# EAGLE design tool-board-atmega (EAGLE 9.4.2)
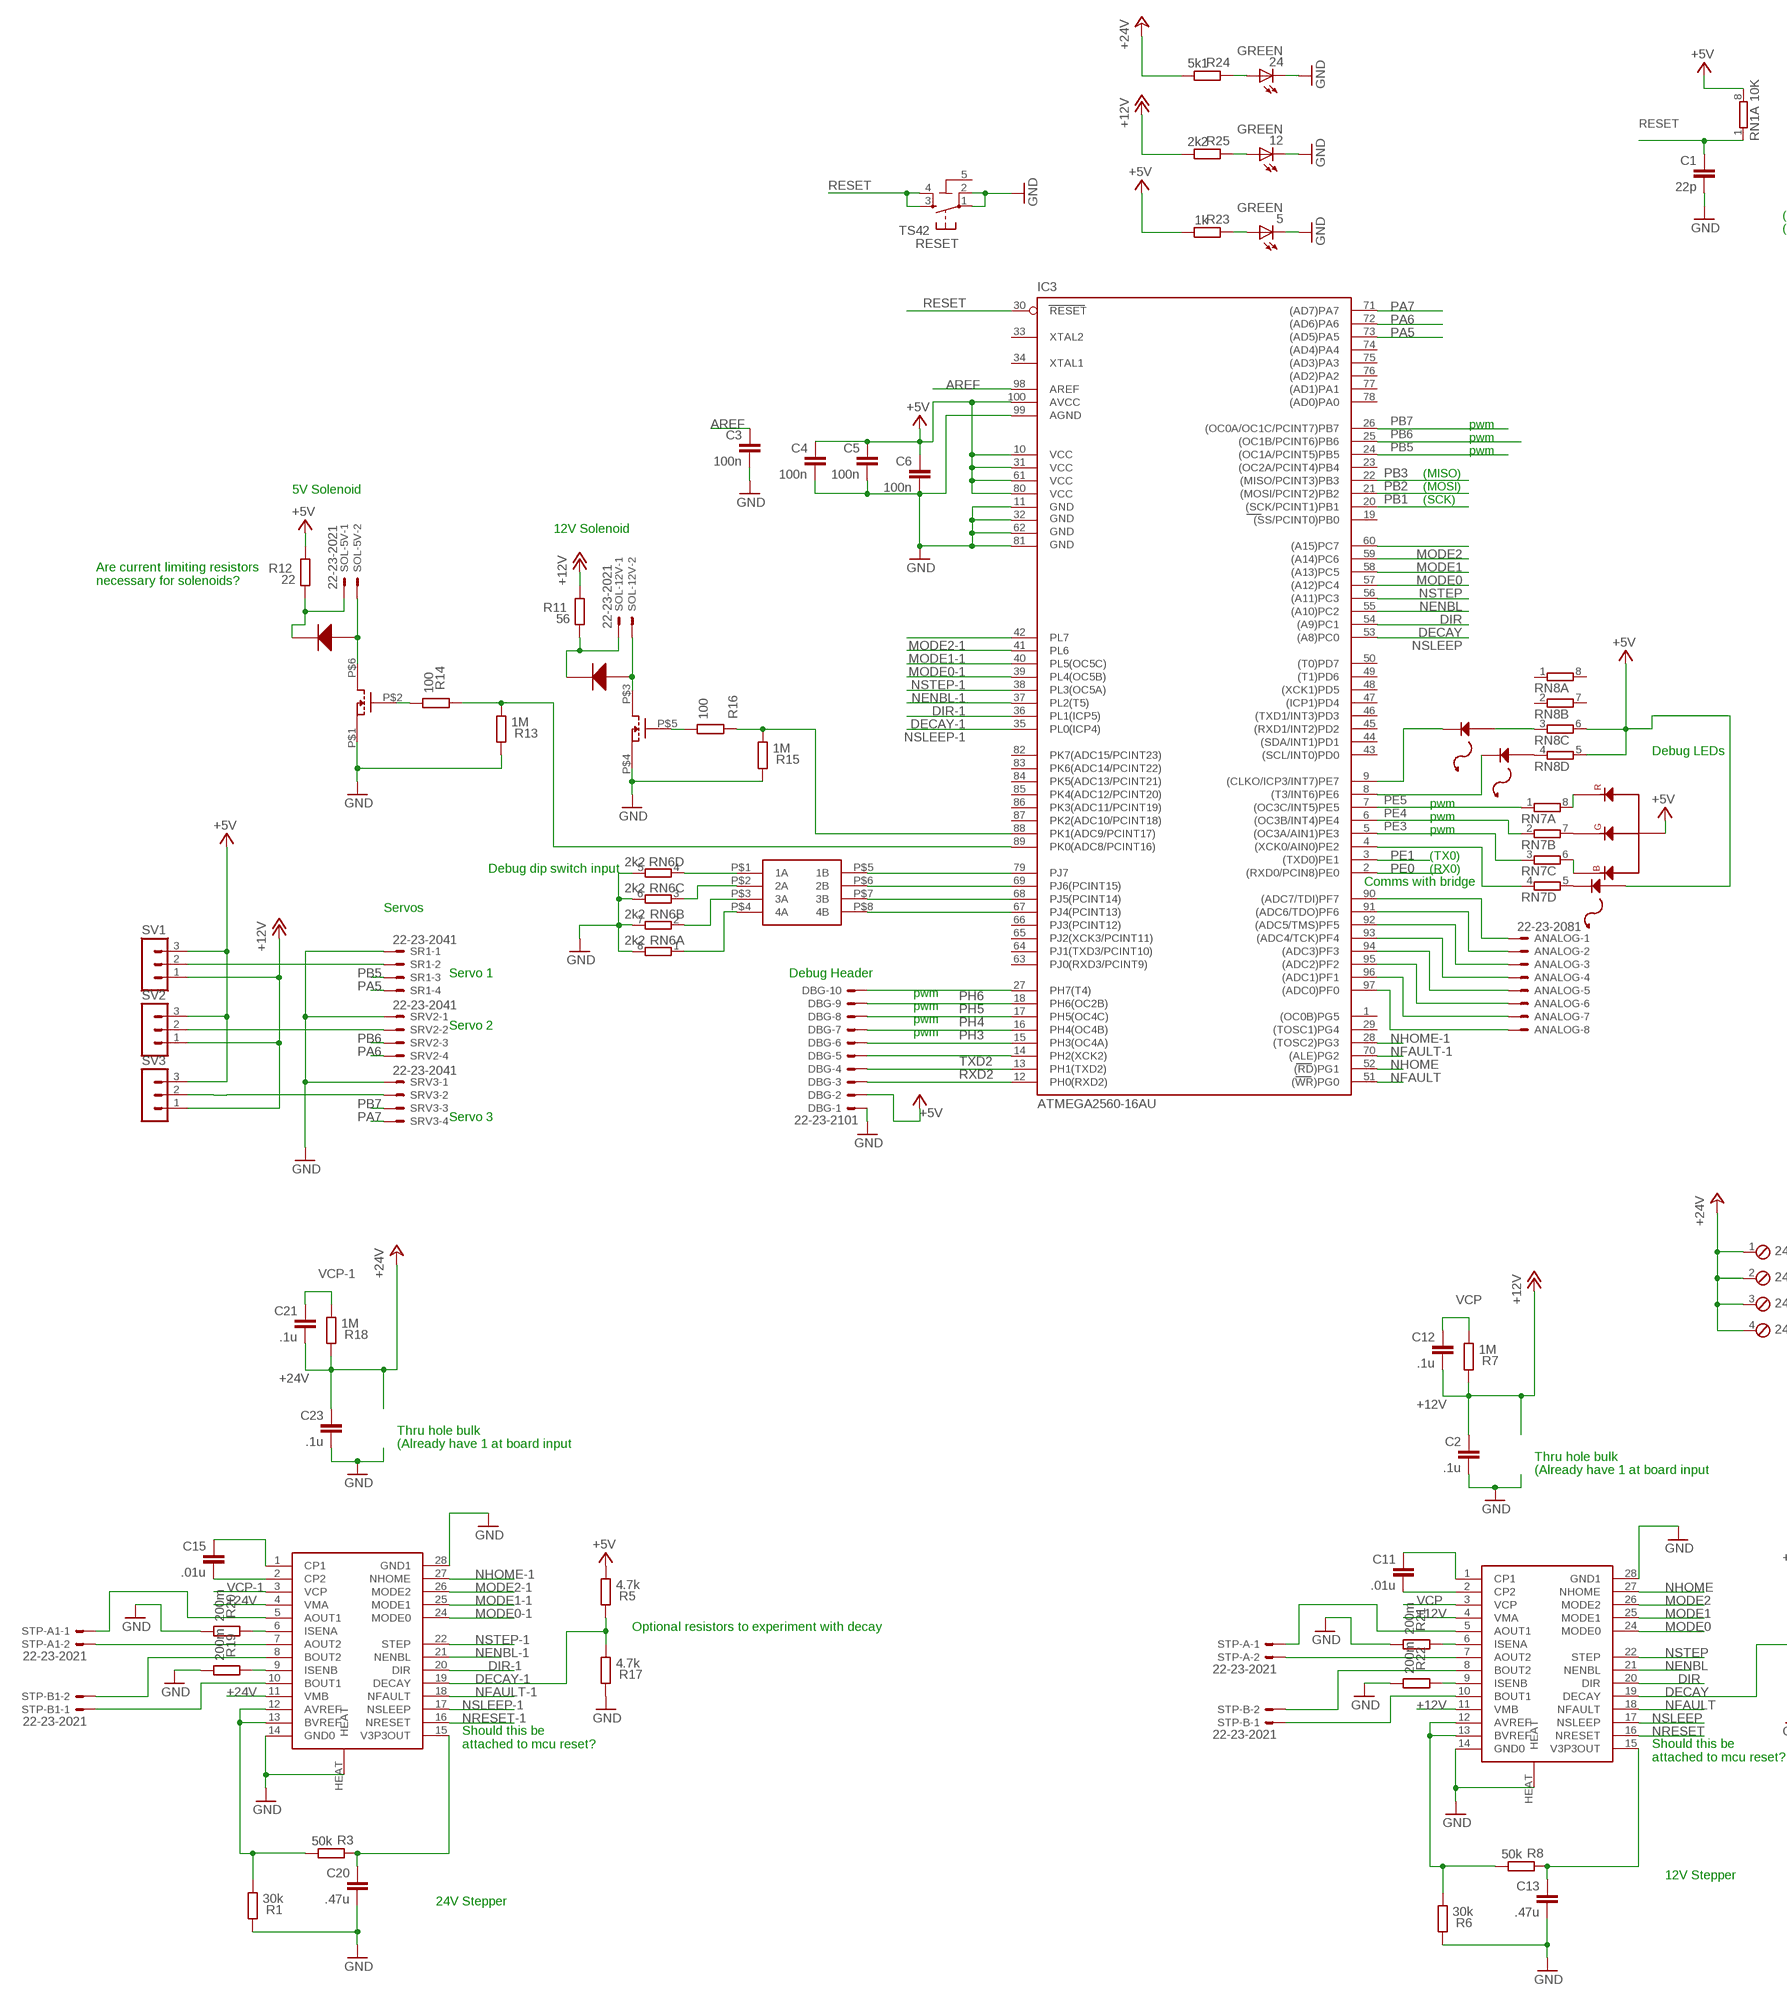
[diagram p0: schematic, sheet 1, part 1 of 2]
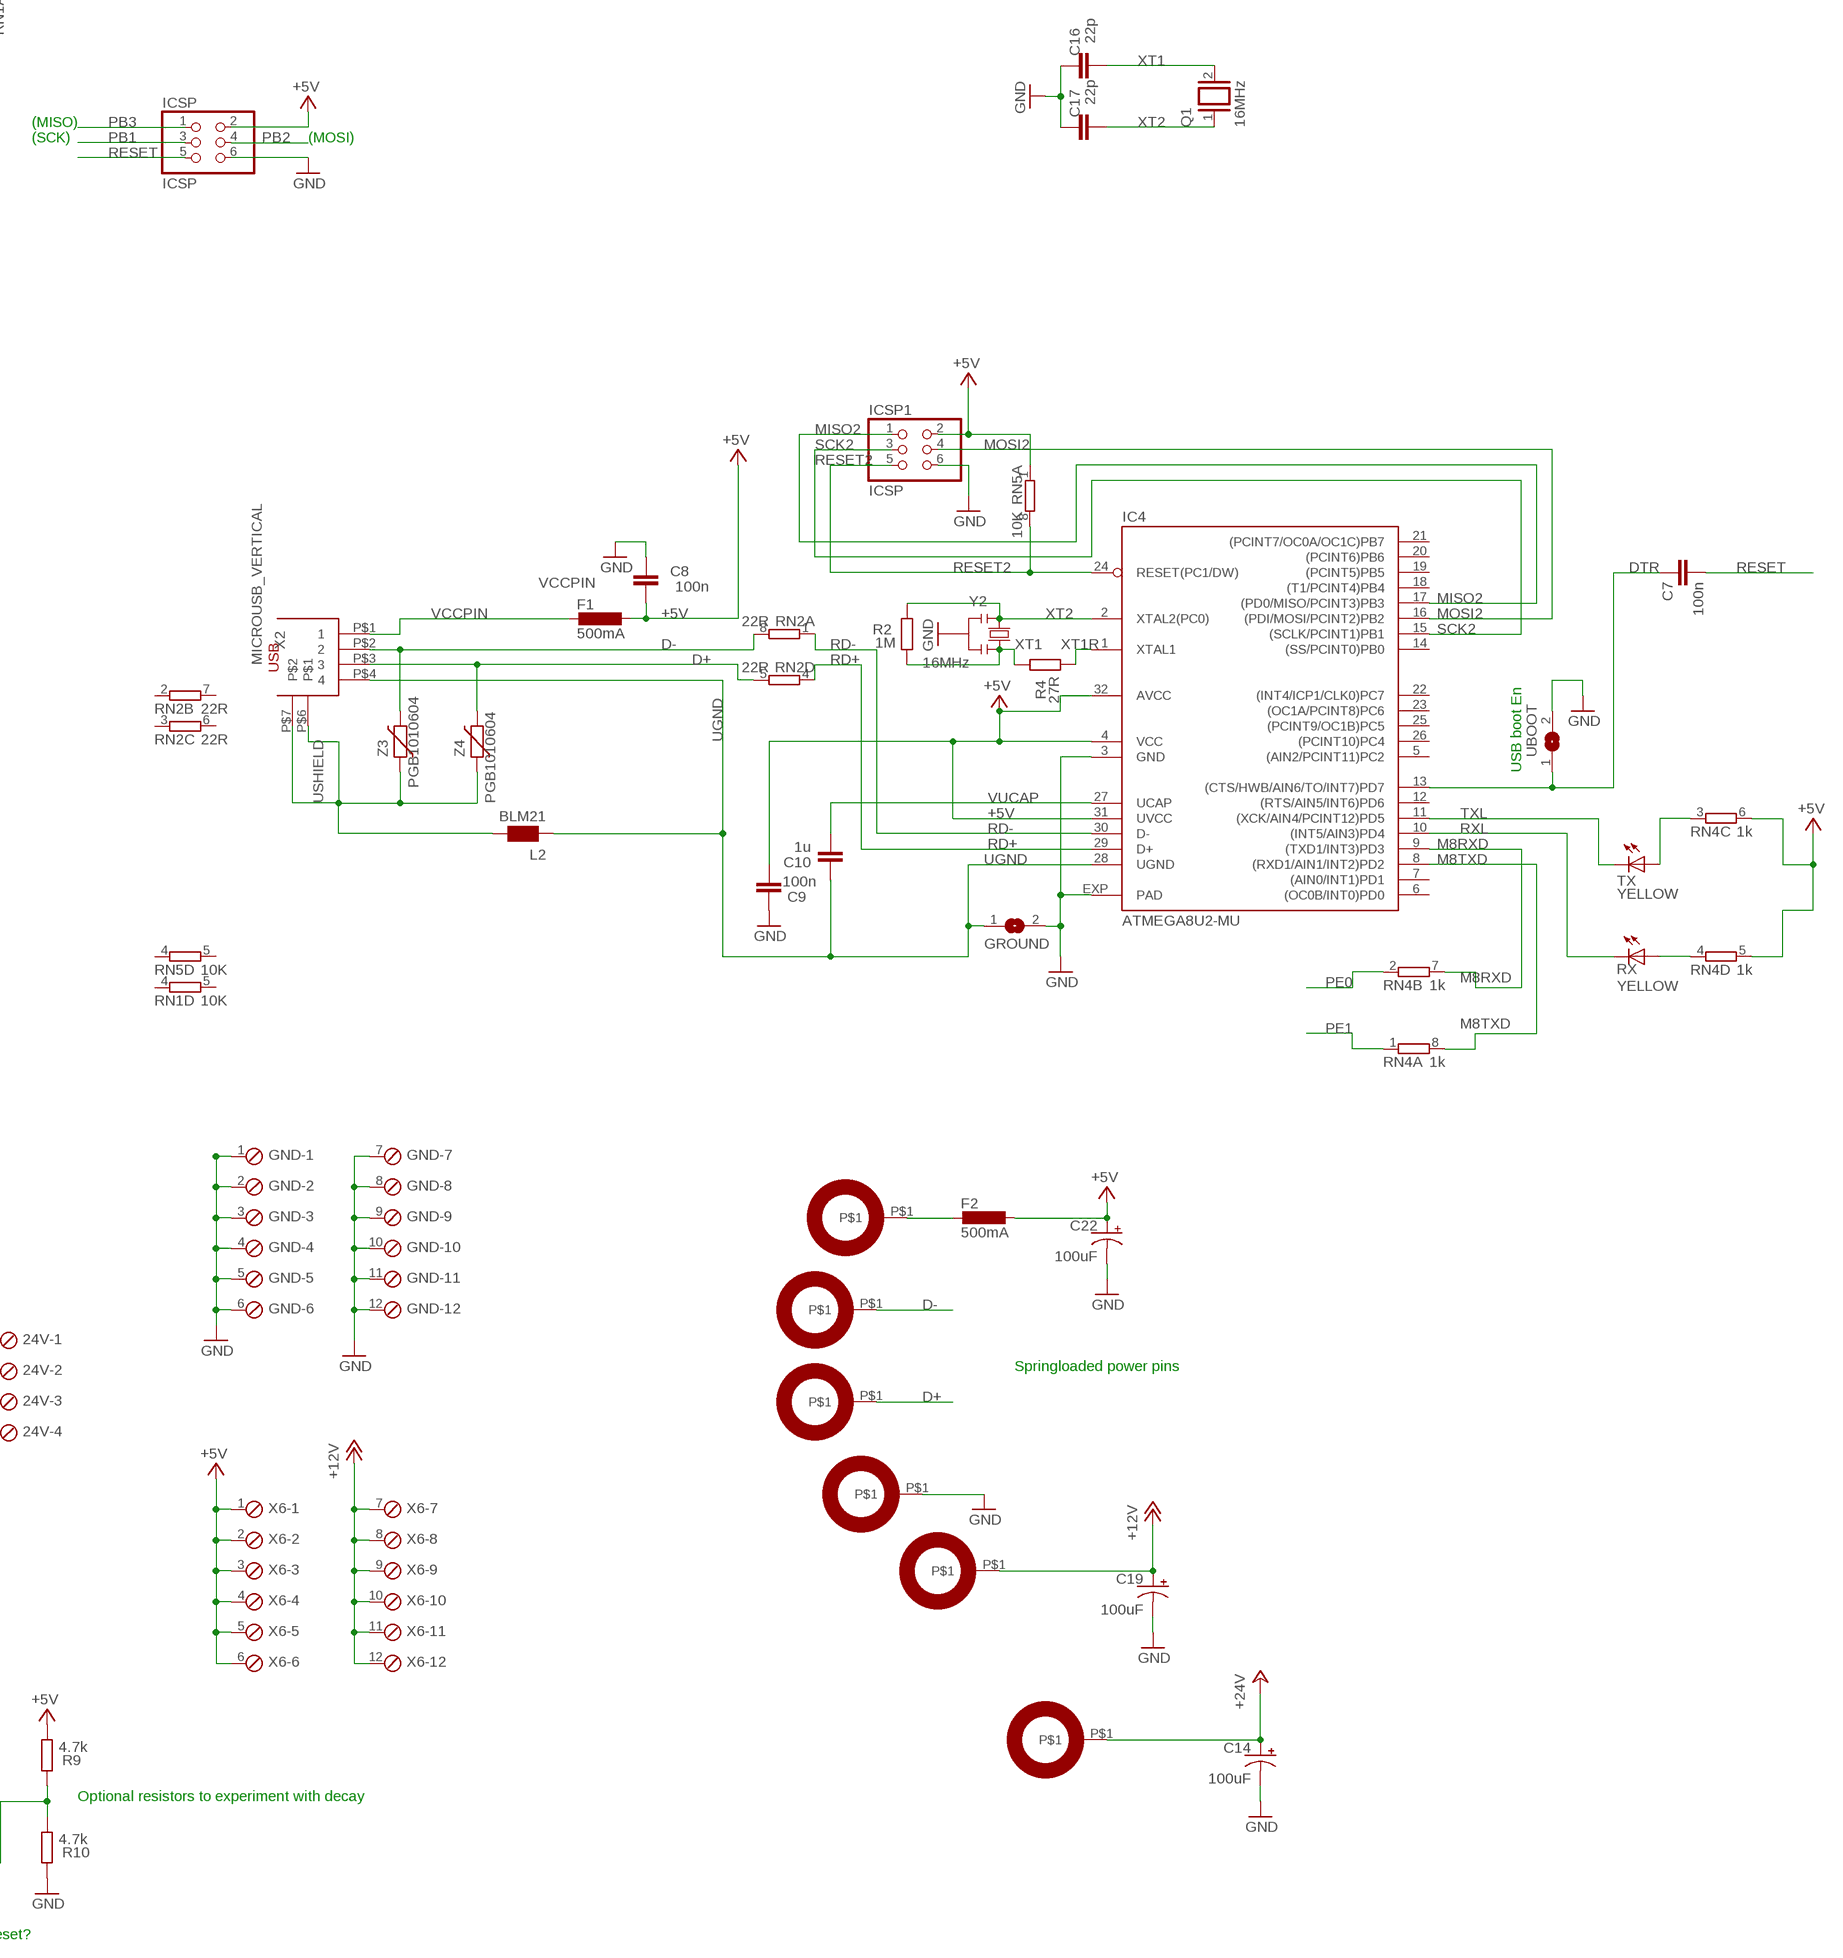
[diagram p1: schematic, sheet 1, part 2 of 2]

## Parts
5  GREEN  LEDCHIP-LED0805  [CHIP-LED0805]
12  GREEN  LEDCHIP-LED0805  [CHIP-LED0805]
24  GREEN  LEDCHIP-LED0805  [CHIP-LED0805]
24V  MPT4  [4POL254]
ANALOG  22-23-2081  [22-23-2081]
C1  22p  C-EU0603-RND  [C0603-ROUND]
C2  .1u  C-EU0603-RND  [C0603-ROUND]
C3  100n  C-EU0603-RND  [C0603-ROUND]
C4  100n  C-EU0603-RND  [C0603-ROUND]
C5  100n  C-EU0603-RND  [C0603-ROUND]
C6  100n  C-EU0603-RND  [C0603-ROUND]
C7  100n  C-EU0603-RND  [C0603-ROUND]
C8  100n  C-EUC0603  [C0603]
C9  100n  C-EU0603-RND  [C0603-ROUND]
C10  1u  C-EU0603-RND  [C0603-ROUND]
C11  .01u  C-EU0603-RND  [C0603-ROUND]
C12  .1u  C-EU0603-RND  [C0603-ROUND]
C13  .47u  C-EU0603-RND  [C0603-ROUND]
C14  100uF  CPOL-USE3.5-8  [E3,5-8]
C15  .01u  C-EU0603-RND  [C0603-ROUND]
C16  22p  C-EU0603-RND  [C0603-ROUND]
C17  22p  C-EU0603-RND  [C0603-ROUND]
C19  100uF  CPOL-USE3.5-8  [E3,5-8]
C20  .47u  C-EU0603-RND  [C0603-ROUND]
C21  .1u  C-EU0603-RND  [C0603-ROUND]
C22  100uF  CPOL-USE3.5-8  [E3,5-8]
C23  .1u  C-EU0603-RND  [C0603-ROUND]
DBG  22-23-2101  [22-23-2101]
F1  500mA  L-EUL1812  [L1812]
F2  500mA  L-EUL1812  [L1812]
GND  MPT12  [12POL254]
GROUND  SJ  [SJ]
IC3  ATMEGA2560-16AU  ATMEGA1280-16AU  [TQFP100]
IC4  ATMEGA8U2-MU  [QFN32]
ICSP  ICSP  PINHD-2X3  [2X03]
ICSP1  ICSP  PINHD-2X3  [2X03]
L2  BLM21  WE-CBF_0805  [0805]
Q1  16MHz  XTAL/S  [QS]
R1  30k  R-EU_R0603  [R0603-ROUND]
R2  1M  R-EU_R0603  [R0603-ROUND]
R3  50k  R-EU_R0603  [R0603-ROUND]
R4  27R  R-EU_R0603  [R0603-ROUND]
R5  4.7k  R-EU_R0603  [R0603-ROUND]
R6  30k  R-EU_R0603  [R0603-ROUND]
R7  1M  R-EU_R0603  [R0603-ROUND]
R8  50k  R-EU_R0603  [R0603-ROUND]
R9  4.7k  R-EU_R0603  [R0603-ROUND]
R10  4.7k  R-EU_R0603  [R0603-ROUND]
R11  56  R-EU_R0603  [R0603-ROUND]
R12  22  R-EU_R0603  [R0603-ROUND]
R13  1M  R-EU_R0603  [R0603-ROUND]
R14  100  R-EU_R0603  [R0603-ROUND]
R15  1M  SMARTPRJ_R-EU_0603-RND  [SMARTPRJ_R0603-ROUND]
R16  100  R-EU_R0603  [R0603-ROUND]
R17  4.7k  R-EU_R0603  [R0603-ROUND]
R18  1M  R-EU_R0603  [R0603-ROUND]
R19  200m  R-EU_R0603  [R0603-ROUND]
R20  200m  R-EU_R0603  [R0603-ROUND]
R21  200m  R-EU_R0603  [R0603-ROUND]
R22  200m  R-EU_R0603  [R0603-ROUND]
R23  1k  R-EU_R0603  [R0603-ROUND]
R24  5k1  R-EU_R0603  [R0603-ROUND]
R25  2k2  R-EU_R0603  [R0603-ROUND]
RESET  TS42  [TS42]
RN1  10K  4R-NCAT16  [CAT16]
RN2  22R  4R-NCAY16  [CAY16]
RN4  1k  4R-NCAY16  [CAY16]
RN5  10K  4R-NCAT16  [CAT16]
RN6  2k2  4R-NCAY16  [CAY16]
RN7  4R-NCAY16  [CAY16]
RN8  4R-NCAY16  [CAY16]
RX  YELLOW  LEDCHIP-LED0805  [CHIP-LED0805]
SOL-5V  22-23-2021  [22-23-2021]
SOL-12V  22-23-2021  [22-23-2021]
SR1  22-23-2041  [22-23-2041]
SRV2  22-23-2041  [22-23-2041]
SRV3  22-23-2041  [22-23-2041]
STP1  DRV8825  [DRV8825]
STP2  DRV8825  [DRV8825]
STP-A  22-23-2021  [22-23-2021]
STP-A1  22-23-2021  [22-23-2021]
STP-B  22-23-2021  [22-23-2021]
STP-B1  22-23-2021  [22-23-2021]
SV1  MA03-1  [MA03-1]
SV2  MA03-1  [MA03-1]
SV3  MA03-1  [MA03-1]
TX  YELLOW  LEDCHIP-LED0805  [CHIP-LED0805]
U$6  SPRING_CONTACT  [SPRING_CONTACT]
U$8  SMD_4P_SW  [SMD_4P_SWITCH]
U$9  SPRING_CONTACT  [SPRING_CONTACT]
U$10  SPRING_CONTACT  [SPRING_CONTACT]
U$11  SPRING_CONTACT  [SPRING_CONTACT]
U$12  SPRING_CONTACT  [SPRING_CONTACT]
U$13  SPRING_CONTACT  [SPRING_CONTACT]
U$15  DUALNMOS-SSM6N7002KFULFCT  [SC-88]
U$16  0603DIODE  [SMARTPRJ_C0603-ROUND]
U$17  0603DIODE  [SMARTPRJ_C0603-ROUND]
U$18  RGBLED  [RGBLED]
U$19  0805LED  [0805LED]
U$20  0603LED  [SMARTPRJ_C0603-ROUND]
U$21  0603LED  [SMARTPRJ_C0603-ROUND]
UBOOT  SJ  [SJ]
X2  MICROUSB_VERTICAL  [MICROUSB_VERT]
X6  MPT12  [12POL254]
Y2  16MHz  RESONATORMU  [RESONATOR]
Z3  PGB1010604  VARISTORCN0603  [CT/CN0603]
Z4  PGB1010604  VARISTORCN0603  [CT/CN0603]

## Nets
+5V: C4.1 C5.1 C6.1 C8.1 C9.1 C22.+ DBG.2 F1.1 F2.1 IC3.10(VCC) IC3.31(VCC1) IC3.61(VCC2) IC3.80(VCC3) IC3.100(AVCC) IC4.4(VCC) IC4.31(UVCC) IC4.32(AVCC) ICSP1.2 ICSP.2 R5.1 R9.1 R12.2 R23.1 RN1.8 RN4.5 RN4.6 RN5.1 RN8.5 RN8.6 SV1.3 SV2.3 SV3.3 U$18.P$4 U$19.P$1(A) X6.1 X6.2 X6.3 X6.4 X6.5 X6.6
+12V: C2.1 C12.2 C19.+ R7.2 R11.2 R25.1 STP2.4(VMA) STP2.11(VMB) SV1.1 SV2.1 SV3.1 U$12.P$1 X6.7 X6.8 X6.9 X6.10 X6.11 X6.12
+24V: 24V.1 24V.2 24V.3 24V.4 C14.+ C21.2 C23.1 R18.2 R24.1 STP1.4(VMA) STP1.11(VMB) U$6.P$1
AREF: C3.1 IC3.98(AREF)
D+: RN2.5 U$13.P$1 X2.P$3 Z4.2
D-: RN2.8 U$10.P$1 X2.P$2 Z3.2
DECAY: IC3.54((A9)PC1) R9.2 R10.1 STP2.19(DECAY)
DECAY-1: IC3.36(PL1(ICP5)) R5.2 R17.1 STP1.19(DECAY)
DIR: IC3.55((A10)PC2) STP2.20(DIR)
DIR-1: IC3.37(PL2(T5)) STP1.20(DIR)
DTR: C7.1 IC4.13((CTS/HWB/AIN6/TO/INT7)PD7) UBOOT.1
GND: 5.C 12.C 24.C C1.2 C2.2 C3.2 C4.2 C5.2 C6.2 C8.2 C9.2 C13.2 C14.- C16.2 C17.2 C19.- C20.2 C22.- C23.2 DBG.1 GND.1 GND.2 GND.3 GND.4 GND.5 GND.6 GND.7 GND.8 GND.9 GND.10 GND.11 GND.12 GROUND.2 IC3.11(GND) IC3.32(GND1) IC3.62(GND2) IC3.81(GND3) IC3.99(AGND) IC4.3(GND) IC4.EXP(PAD) ICSP1.6 ICSP.6 R1.2 R6.2 R10.2 R13.2 R15.2 R17.2 R19.1 R20.1 R21.1 R22.1 RESET.1 RESET.2 RN6.5 RN6.6 RN6.7 RN6.8 SR1.1 SRV2.1 SRV3.1 STP1.14(GND0) STP1.28(GND1) STP1.HEAT STP2.14(GND0) STP2.28(GND1) STP2.HEAT U$11.P$1 U$15.P$1(S) U$15.P$4(S) UBOOT.2 Y2.2
M8RXD: IC4.9((TXD1/INT3)PD3) RN4.7
M8TXD: IC4.8((RXD1/AIN1/INT2)PD2) RN4.8
MISO2: IC4.17((PD0/MISO/PCINT3)PB3) ICSP1.1
MODE0: IC3.58((A13)PC5) STP2.24(MODE0)
MODE0-1: IC3.40(PL5(OC5C)) STP1.24(MODE0)
MODE1: IC3.59((A14)PC6) STP2.25(MODE1)
MODE1-1: IC3.41(PL6) STP1.25(MODE1)
MODE2: IC3.60((A15)PC7) STP2.26(MODE2)
MODE2-1: IC3.42(PL7) STP1.26(MODE2)
MOSI2: IC4.16((PDI/MOSI/PCINT2)PB2) ICSP1.4
N$1: C11.1 STP2.1(CP1)
N$2: R14.1 U$15.P$2(G)
N$3: 5.A R23.2
N$4: C11.2 STP2.2(CP2)
N$5: RN6.4 U$8.P$1(1A)
N$6: R6.1 R8.1 STP2.12(AVREF) STP2.13(BVREF)
N$7: STP2.5(AOUT1) STP-A.1
N$8: STP2.7(AOUT2) STP-A.2
N$9: RN6.3 U$8.P$2(2A)
N$10: RN6.2 U$8.P$3(3A)
N$11: RN6.1 U$8.P$4(4A)
N$12: STP2.8(BOUT2) STP-B.2
N$13: STP2.10(BOUT1) STP-B.1
N$14: C13.1 R8.2 STP2.15(V3P3OUT)
N$15: IC3.88(PK1(ADC9/PCINT17)) R15.1 R16.2
N$16: IC3.89(PK0(ADC8/PCINT16)) R13.1 R14.2
N$17: SOL-12V.2 U$15.P$3(D) U$16.1(A)
N$18: SOL-5V.2 U$15.P$6(D) U$17.1(A)
N$19: R11.1 SOL-12V.1 U$16.2(K)
N$20: DBG.10 IC3.27(PH7(T4))
N$21: R12.1 SOL-5V.1 U$17.2(K)
N$22: DBG.5 IC3.14(PH2(XCK2))
N$23: RN7.6 U$18.P$3
N$24: RN7.7 U$18.P$2
N$25: RN7.8 U$18.P$1
N$26: IC3.4((XCK0/AIN0)PE2) RN7.4
N$27: RN7.5 U$19.P$2(K)
N$28: IC3.9((CLKO/ICP3/INT7)PE7) U$21.2(K)
N$29: IC3.8((T3/INT6)PE6) U$20.2(K)
N$30: RN8.4 U$20.1(A)
N$31: RN8.3 U$21.1(A)
N$32: IC3.67(PJ4(PCINT13)) U$8.P$8(4B)
N$33: IC3.68(PJ5(PCINT14)) U$8.P$7(3B)
N$34: IC3.69(PJ6(PCINT15)) U$8.P$6(2B)
N$35: IC3.79(PJ7) U$8.P$5(1B)
N$36: R16.1 U$15.P$5(G)
N$37: R19.2 STP1.9(ISENB)
N$38: F2.2 U$9.P$1
N$39: C15.1 STP1.1(CP1)
N$40: C15.2 STP1.2(CP2)
N$41: C20.1 R3.2 STP1.15(V3P3OUT)
N$42: R1.1 R3.1 STP1.12(AVREF) STP1.13(BVREF)
N$43: STP1.5(AOUT1) STP-A1.1
N$44: STP1.7(AOUT2) STP-A1.2
N$45: STP1.8(BOUT2) STP-B1.2
N$46: STP1.10(BOUT1) STP-B1.1
N$47: R20.2 STP1.6(ISENA)
N$48: R21.2 STP2.6(ISENA)
N$49: R22.2 STP2.9(ISENB)
N$50: ANALOG.1 IC3.90((ADC7/TDI)PF7)
N$51: ANALOG.2 IC3.91((ADC6/TDO)PF6)
N$52: ANALOG.3 IC3.92((ADC5/TMS)PF5)
N$53: ANALOG.4 IC3.93((ADC4/TCK)PF4)
N$54: RN4.4 RX.A
N$55: RN4.3 TX.A
N$56: ANALOG.5 IC3.94((ADC3)PF3)
N$57: ANALOG.6 IC3.95((ADC2)PF2)
N$58: ANALOG.7 IC3.96((ADC1)PF1)
N$59: ANALOG.8 IC3.97((ADC0)PF0)
N$60: SR1.2 SV1.2
N$61: SRV2.2 SV2.2
N$62: SRV3.2 SV3.2
N$64: 24.A R24.2
N$66: 12.A R25.2
NENBL: IC3.56((A11)PC3) STP2.21(NENBL)
NENBL-1: IC3.38(PL3(OC5A)) STP1.21(NENBL)
NFAULT: IC3.51((WR)PG0) STP2.18(NFAULT)
NFAULT-1: IC3.70((ALE)PG2) STP1.18(NFAULT)
NHOME: IC3.52((RD)PG1) STP2.27(NHOME)
NHOME-1: IC3.28((TOSC2)PG3) STP1.27(NHOME)
NRESET: STP2.16(NRESET)
NRESET-1: STP1.16(NRESET)
NSLEEP: IC3.53((A8)PC0) STP2.17(NSLEEP)
NSLEEP-1: IC3.35(PL0(ICP4)) STP1.17(NSLEEP)
NSTEP: IC3.57((A12)PC4) STP2.22(STEP)
NSTEP-1: IC3.39(PL4(OC5B)) STP1.22(STEP)
PA5: IC3.73((AD5)PA5) SR1.4
PA6: IC3.72((AD6)PA6) SRV2.4
PA7: IC3.71((AD7)PA7) SRV3.4
PB1: IC3.20((SCK/PCINT1)PB1) ICSP.3
PB2: IC3.21((MOSI/PCINT2)PB2) ICSP.4
PB3: IC3.22((MISO/PCINT3)PB3) ICSP.1
PB5: IC3.24((OC1A/PCINT5)PB5) SR1.3
PB6: IC3.25((OC1B/PCINT6)PB6) SRV2.3
PB7: IC3.26((OC0A/OC1C/PCINT7)PB7) SRV3.3
PE0: IC3.2((RXD0/PCIN8)PE0) RN4.2
PE1: IC3.3((TXD0)PE1) RN4.1
PE3: IC3.5((OC3A/AIN1)PE3) RN7.3
PE4: IC3.6((OC3B/INT4)PE4) RN7.2
PE5: IC3.7((OC3C/INT5)PE5) RN7.1
PH3: DBG.6 IC3.15(PH3(OC4A))
PH4: DBG.7 IC3.16(PH4(OC4B))
PH5: DBG.8 IC3.17(PH5(OC4C))
PH6: DBG.9 IC3.18(PH6(OC2B))
RD+: IC4.29(D+) RN2.4
RD-: IC4.30(D-) RN2.1
RESET: C1.1 C7.2 IC3.30(RESET) ICSP.5 RESET.3 RESET.4 RN1.1
RESET2: IC4.24(RESET(PC1/DW)) ICSP1.5 RN5.8
RXD2: DBG.3 IC3.12(PH0(RXD2))
RXL: IC4.10((INT5/AIN3)PD4) RX.C
SCK2: IC4.15((SCLK/PCINT1)PB1) ICSP1.3
TXD2: DBG.4 IC3.13(PH1(TXD2))
TXL: IC4.11((XCK/AIN4/PCINT12)PD5) TX.C
UGND: C10.2 GROUND.1 IC4.28(UGND) L2.1 X2.P$4
USHIELD: L2.2 X2.P$6 X2.P$7 Z3.1 Z4.1
VCCPIN: F1.2 X2.P$1
VCP: C12.1 R7.1 STP2.3(VCP)
VCP-1: C21.1 R18.1 STP1.3(VCP)
VUCAP: C10.1 IC4.27(UCAP)
XT1: C16.1 Q1.2 R2.1 R4.2 Y2.3
XT1R: IC4.1(XTAL1) R4.1
XT2: C17.1 IC4.2(XTAL2(PC0)) Q1.1 R2.2 Y2.1
Unconnected: IC3.1((OC0B)PG5) IC3.19((SS/PCINT0)PB0) IC3.23((OC2A/PCINT4)PB4) IC3.29((TOSC1)PG4) IC3.33(XTAL2) IC3.34(XTAL1) IC3.43((SCL/INT0)PD0) IC3.44((SDA/INT1)PD1) IC3.45((RXD1/INT2)PD2) IC3.46((TXD1/INT3)PD3) IC3.47((ICP1)PD4) IC3.48((XCK1)PD5) IC3.49((T1)PD6) IC3.50((T0)PD7) IC3.63(PJ0(RXD3/PCINT9)) IC3.64(PJ1(TXD3/PCINT10)) IC3.65(PJ2(XCK3/PCINT11)) IC3.66(PJ3(PCINT12)) IC3.74((AD4)PA4) IC3.75((AD3)PA3) IC3.76((AD2)PA2) IC3.77((AD1)PA1) IC3.78((AD0)PA0) IC3.82(PK7(ADC15/PCINT23)) IC3.83(PK6(ADC14/PCINT22)) IC3.84(PK5(ADC13/PCINT21)) IC3.85(PK4(ADC12/PCINT20)) IC3.86(PK3(ADC11/PCINT19)) IC3.87(PK2(ADC10/PCINT18)) IC4.5((AIN2/PCINT11)PC2) IC4.6((OC0B/INT0)PD0) IC4.7((AIN0/INT1)PD1) IC4.12((RTS/AIN5/INT6)PD6) IC4.14((SS/PCINT0)PB0) IC4.18((T1/PCINT4)PB4) IC4.19((PCINT5)PB5) IC4.20((PCINT6)PB6) IC4.21((PCINT7/OC0A/OC1C)PB7) IC4.22((INT4/ICP1/CLK0)PC7) IC4.23((OC1A/PCINT8)PC6) IC4.25((PCINT9/OC1B)PC5) IC4.26((PCINT10)PC4) RN1.2 RN1.3 RN1.4 RN1.5 RN1.6 RN1.7 RN2.2 RN2.3 RN2.6 RN2.7 RN5.2 RN5.3 RN5.4 RN5.5 RN5.6 RN5.7 RN8.1 RN8.2 RN8.7 RN8.8

## Notes on the sheet
- (MISO)
- (SCK) | (MOSI)
- pwm
- pwm
- pwm
- (MISO)
- 5V Solenoid | (MOSI)
- (SCK)
- 12V Solenoid
- Are current limiting resistors
  necessary for solenoids?
- Debug LEDs
- USB boot En
- pwm
- pwm
- pwm
- (TX0)
- Debug dip switch input | (RX0)
- Comms with bridge
- Servos
- Servo 1 | Debug Header
- pwm
- pwm
- pwm
- Servo 2
- pwm
- Servo 3
- Springloaded power pins
- Thru hole bulk
- (Already have 1 at board input
- Thru hole bulk
- (Already have 1 at board input
- Optional resistors to experiment with decay
- Optional resistors to experiment with decay
- Should this be 
  attached to mcu reset?
- Should this be 
  attached to mcu reset?
- 12V Stepper
- 24V Stepper

## Power pins joined to a net without a drawn wire
5-GND: RESET.5(5-GND)

## Library data of the parts
5 12 24 RX TX = led:LED: LED OSRAM: - CHIPLED LG R971, LG N971, LY N971, LG Q971, LY Q971, LO R971, LY R971 LH N974, LH R974 LS Q976, LO Q976, LY Q976 LO Q996 - Hyper CHIPLED LW Q18S LB Q993, LB Q99A, LB R99A - SideLED LS A670, LO A670, LY A670, LG A670, LP A670 LB A673, LV A673, LT A673, LW A673 LH A674 LY A675 LS A676, LA A676, LO A676, LY A676, LW A676 LS A679, LY A679, LG A679 - Hyper Micro SIDELED® LS Y876, LA Y876, LO Y876, LY Y876 LT Y87S - SmartLED LW L88C, LW L88S LB L89C, LB L89S, LG L890 LS L89K, LO L89K, LY L89K LS L896, LA L896, LO L896, LY L896 - TOPLED LS T670, LO T670, LY T670, LG T670, LP T670 LSG T670, LSP T670, LSY T670, LOP T670, LYG T670 LG T671, LOG T671, LSG T671 LB T673, LV T673, LT T673, LW T673 LH T674 LS T676, LA T676, LO T676, LY T676, LB T676, LH T676, LSB T676, LW T676 LB T67C, LV T67C, LT T67C, LS T67K, LO T67K, LY T67K, LW E67C LS E67B, LA E67B, LO E67B, LY E67B, LB E67C, LV E67C, LT E67C LW T67C LS T679, LY T679, LG T679 LS T770, LO T770, LY T770, LG T770, LP T770 LB T773, LV T773, LT T773, LW T773 LH T774 LS E675, LA E675, LY E675, LS T675 LS T776, LA T776, LO T776, LY T776, LB T776 LHGB T686 LT T68C, LB T68C - Hyper Mini TOPLED® LB M676 - Mini TOPLED Santana® LG M470 LS M47K, LO M47K, LY M47K Source: http://www.osram.convergy.de LUXEON: - LUMILED® LXK2-PW12-R00, LXK2-PW12-S00, LXK2-PW14-U00, LXK2-PW14-V00 LXK2-PM12-R00, LXK2-PM12-S00, LXK2-PM14-U00 LXK2-PE12-Q00, LXK2-PE12-R00, LXK2-PE12-S00, LXK2-PE14-T00, LXK2-PE14-U00 LXK2-PB12-K00, LXK2-PB12-L00, LXK2-PB12-M00, LXK2-PB14-N00, LXK2-PB14-P00, LXK2-PB14-Q00 LXK2-PR12-L00, LXK2-PR12-M00, LXK2-PR14-Q00, LXK2-PR14-R00 LXK2-PD12-Q00, LXK2-PD12-R00, LXK2-PD12-S00 LXK2-PH12-R00, LXK2-PH12-S00 LXK2-PL12-P00, LXK2-PL12-Q00, LXK2-PL12-R00 Source: www.luxeon.com KINGBRIGHT: KA-3528ASYC Source: www.kingbright.com
24V = con-phoenix-254:MPT4: PHOENIX CONNECTOR; OC_FARNELL: unknown; OC_NEWARK: unknown
ANALOG = con-molex:22-23-2081: .100" (2.54mm) Center Header - 8 Pin; MF: MOLEX; MPN: 22-23-2081; OC_FARNELL: 1756826; OC_NEWARK: 01C7592
C1-C7 C9-C13 C15-C17 C20 C21 C23 = SmartPrj:C-EU: CAPACITOR, European symbol
C8 = rcl:C-EU: CAPACITOR, European symbol
C14 C19 C22 = rcl:CPOL-US: POLARIZED CAPACITOR, American symbol; SPICEPREFIX: C
DBG = con-molex:22-23-2101: .100" (2.54mm) Center Header - 10 Pin; MF: MOLEX; MPN: 22-23-2101; OC_FARNELL: 1756828; OC_NEWARK: 94C0765
F1 F2 = rcl:L-EU: INDUCTOR, European symbol
GND X6 = con-phoenix-254:MPT12: PHOENIX CONNECTOR; OC_FARNELL: unknown; OC_NEWARK: unknown
GROUND UBOOT = jumper:SJ: SMD solder JUMPER
IC3 = atmel-2005:ATMEGA*: MICROCONTROLLER 64/128/256 Kbytes FLASH 4 Kbytes EEPROM 8 Kbytes SRAM 86 General Purpose I/O pins 12-channels16-bit PWM 4 x Serial USARTs 16-channels 10-bit A/D
IC4 = atmel:ATMEGA8U2-MU
ICSP ICSP1 = pinhead:PINHD-2X3: PIN HEADER
L2 = wuerth-elektronik:WE-CBF: SMD EMI Suppression Ferrite Beads - excellent anti-EMI properties - low DCR - impedances till 3000 ohms - rated current up to 6 A
Q1 = special:XTAL/S: CRYSTAL
R1-R14 R16-R25 = SmartPrj:R-EU_: RESISTOR, European symbol
R15 = tool-board-atmega:SMARTPRJ_R-EU_: RESISTOR, European symbol
RESET = st-mod v1.4:TS42: TS42 Dongnan Electronics Tact switch VDC 12V - 50mA
RN1 RN2 RN4 RN5 = resistor-dil:4R-N: Array Chip Resistor Source: RS Component / Phycomp
RN6-RN8 = resistor-dil:4R-N: Array Chip Resistor Source: RS Component / Phycomp; OC_FARNELL: unknown; OC_NEWARK: unknown
SOL-5V SOL-12V STP-A STP-A1 STP-B STP-B1 = con-molex:22-23-2021: .100" (2.54mm) Center Header - 2 Pin; MF: MOLEX; MPN: 22-23-2021; OC_FARNELL: 1462926; OC_NEWARK: 25C3832
SR1 SRV2 SRV3 = con-molex:22-23-2041: .100" (2.54mm) Center Header - 4 Pin; MF: MOLEX; MPN: 22-23-2041; OC_FARNELL: 1462920; OC_NEWARK: 38C0355
STP1 STP2 = ClinicalRobotics:DRV8825
SV1-SV3 = con-lstb:MA03-1: PIN HEADER; OC_FARNELL: unknown; OC_NEWARK: unknown
U$6 U$9-U$13 = ClinicalRobotics:SPRING_CONTACT
U$8 = ClinicalRobotics:SMD_4P_SW: https://www.digikey.com/product-detail/en/cts-electrocomponents/218-4LPST/CT2184LPST-ND/267320
U$15 = ClinicalRobotics:DUALNMOS-SSM6N7002KFULFCT
U$16 U$17 = ClinicalRobotics:0603DIODE
U$18 = ClinicalRobotics:RGBLED
U$19 = ClinicalRobotics:0805LED
U$20 U$21 = ClinicalRobotics:0603LED
X2 = ClinicalRobotics:MICROUSB_VERTICAL
Y2 = SmartPrj:RESONATOR
Z3 Z4 = varistor:VARISTOR: VARISTOR

## Net classes
0 default: width 0.152 mm, drill 0.305 mm, clearance 0.152 mm

## Board
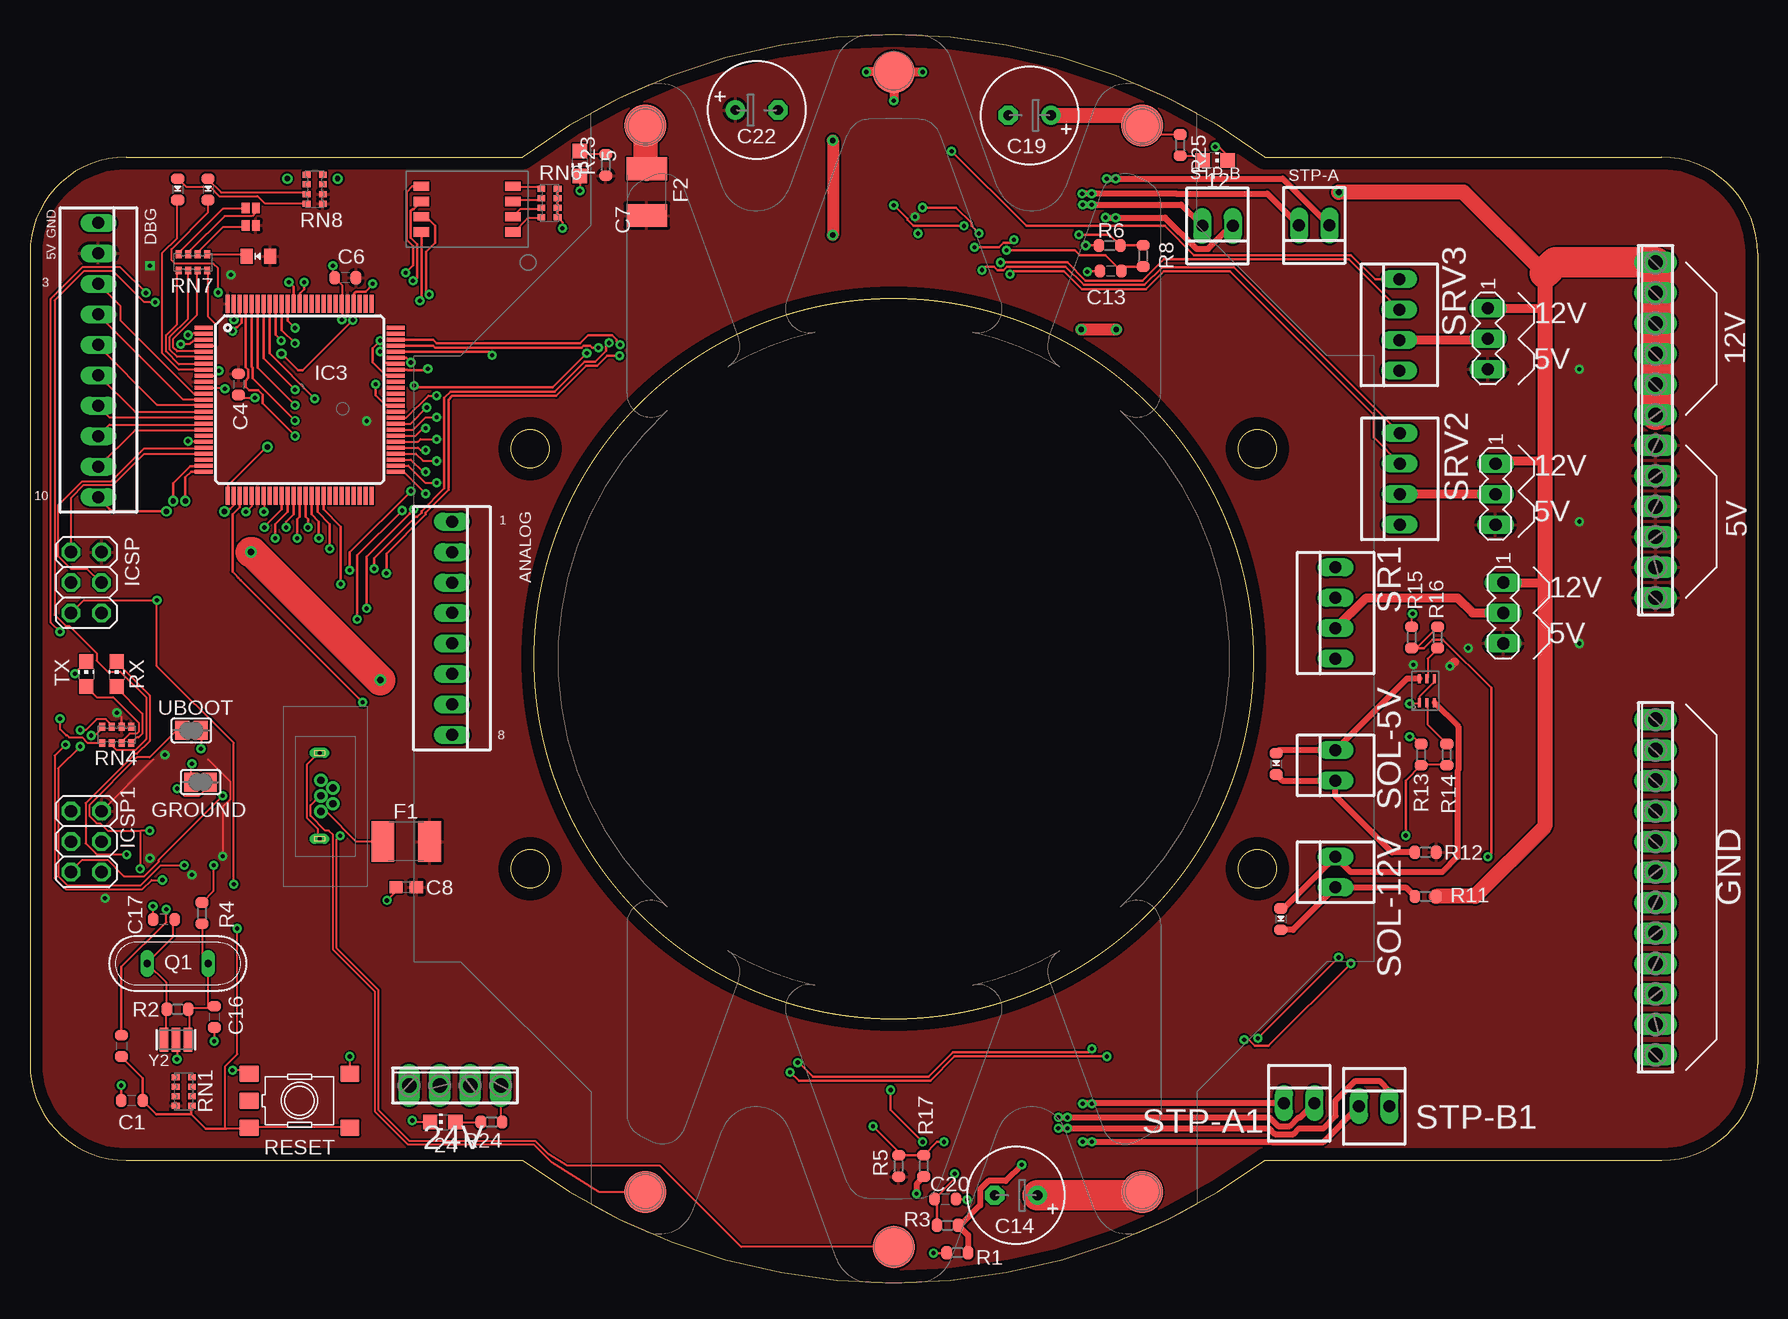
[diagram p2: board, top side]
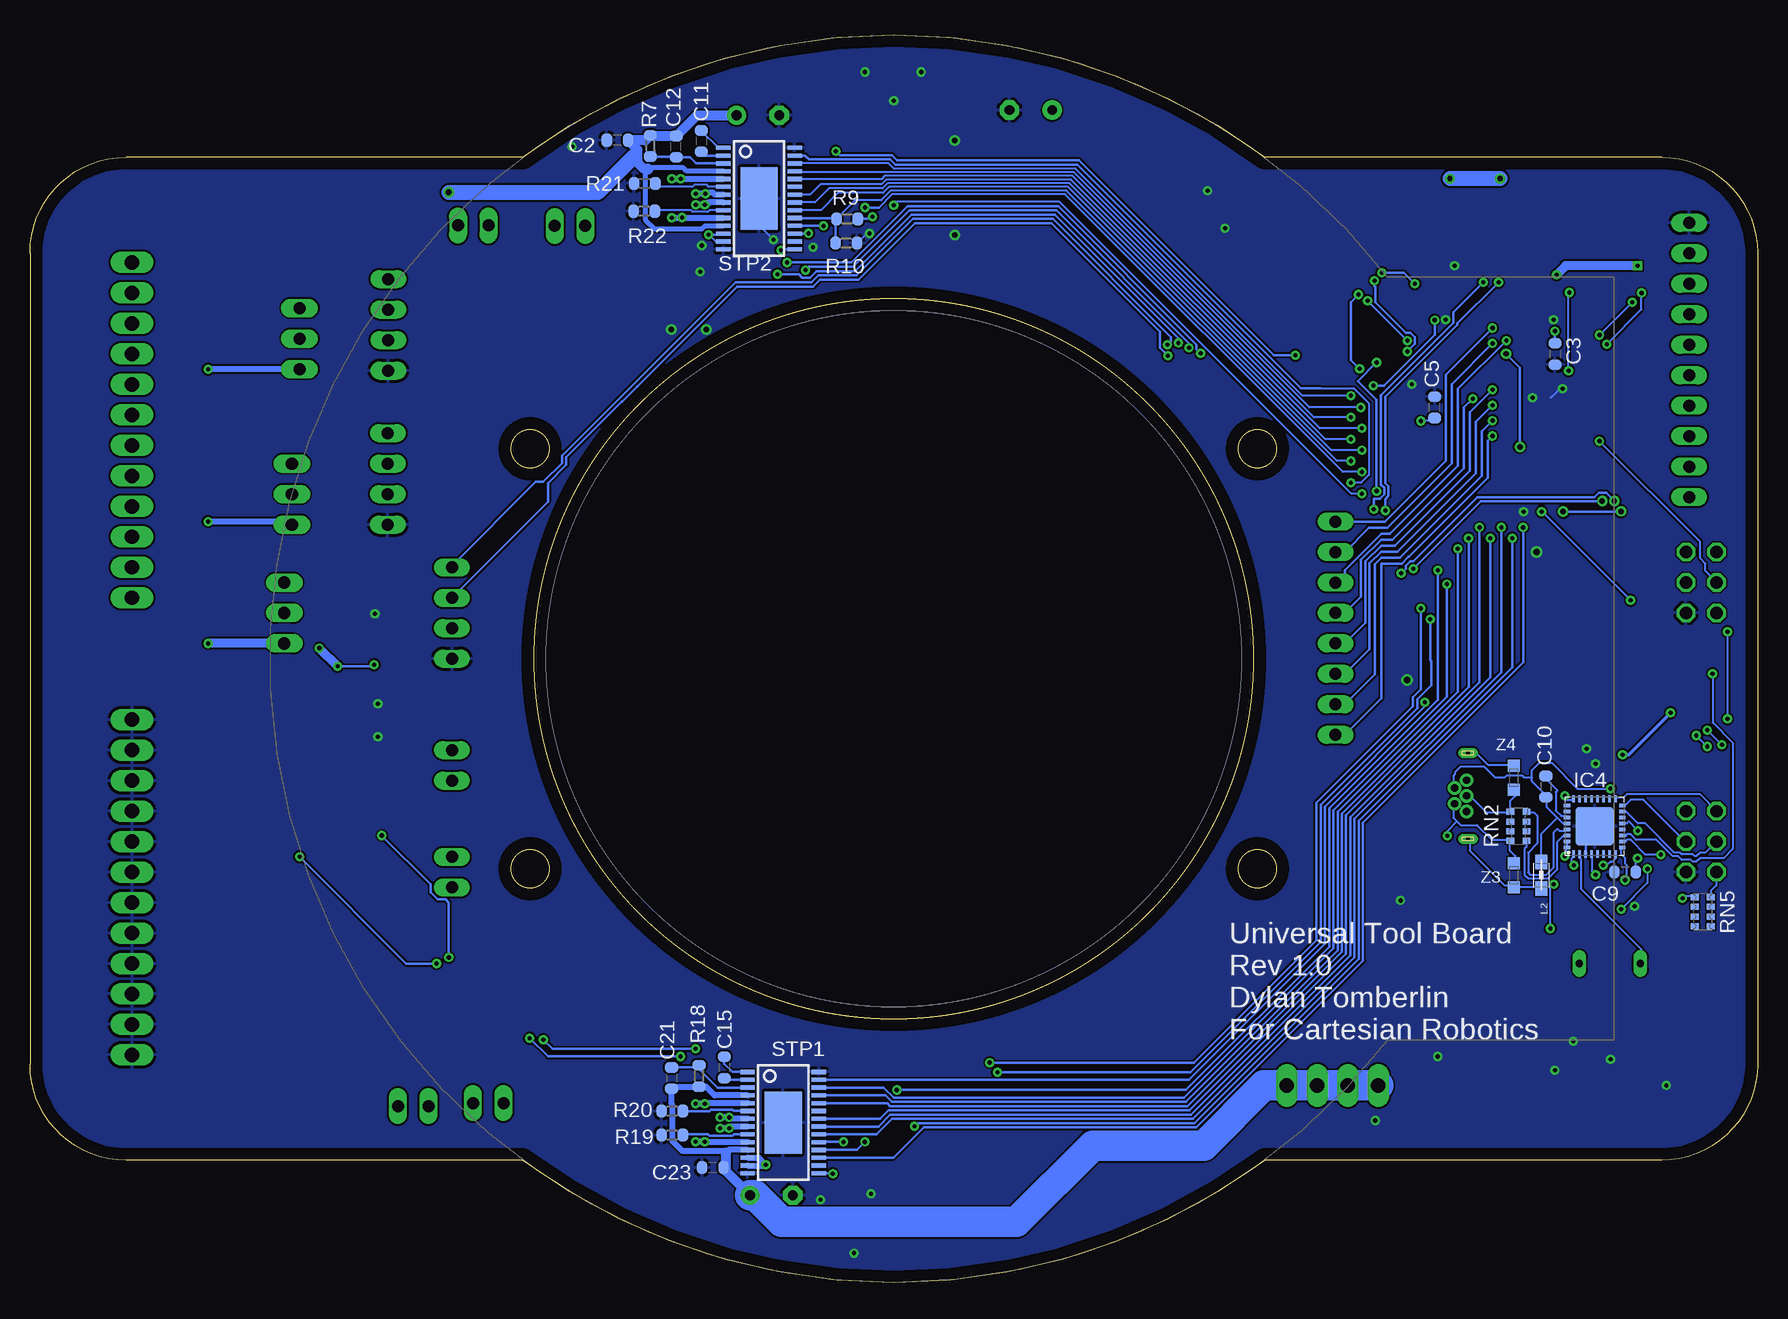
[diagram p3: board, bottom side, seen from below]

Size 144 x 104 mm. Coordinates in mm from the lower left corner, seen from the top.
Outline: 41.07,10.2 arc73 102.93,10.2 136,10.2 arc90 144,18.2 144,85.8 arc90 136,93.8 102.93,93.8 arc73 41.07,93.8 8,93.8 arc90 0,85.8 0,18.2 arc90 8,10.2 41.07,10.2
Outline: circle at 102.31,69.5 radius 1.6
Outline: circle at 102.31,34.5 radius 1.6
Outline: circle at 41.69,34.5 radius 1.6
Outline: circle at 41.69,69.5 radius 1.6
Outline: circle at 72,52 radius 30
Copper layers (1*16): Top 0.035mm / dielectric 1.5mm / Bottom 0.035mm
Design rules "default": minimum track width 6mil, minimum drill 0.35mm, track to track 6mil, track to pad 6mil, pad to pad 6mil, via to via 6mil, smd to smd 6mil, copper to edge 40mil, drill to drill 6mil, minimum pad ring 10mil, minimum via ring 8mil, stop-mask expansion 4mil, vias tented up to drill 0mil, thermal gap 10mil

### Footprints (pad centres in the part's own frame; a part is rotated, then mirrored left to right if it is on the bottom)
CHIP-LED0805 = smd 1.2 x 1.2: A 0,-1.05; C 0,1.05
4POL254 = drill 1.2 long: 1 -3.81,0; 2 -1.27,0; 3 1.27,0; 4 3.81,0
22-23-2081 = drill 1 long: 1 -8.89,0; 2 -6.35,0; 3 -3.81,0; 4 -1.27,0; 5 1.27,0; 6 3.81,0; 7 6.35,0; 8 8.89,0
C0603-ROUND = smd 0.898 x 1.1: 1 -0.889,0; 2 0.889,0
C0603 = smd 1.1 x 1: 1 -0.85,0; 2 0.85,0
E3,5-8 = drill 0.813 pad 1.6: + -1.778,0 | drill 0.813 pad 1.6 octagon: - 1.778,0
22-23-2101 = drill 1 long: 1 -11.43,0; 2 -8.89,0; 3 -6.35,0; 4 -3.81,0; 5 -1.27,0; 6 1.27,0; 7 3.81,0; 8 6.35,0; 9 8.89,0; 10 11.43,0
L1812 = smd 1.9 x 3.4: 1 -1.95,0; 2 1.95,0
12POL254 = drill 1.2 long: 1 -13.97,0; 2 -11.43,0; 3 -8.89,0; 4 -6.35,0; 5 -3.81,0; 6 -1.27,0; 7 1.27,0; 8 3.81,0; 9 6.35,0; 10 8.89,0; 11 11.43,0; 12 13.97,0
SJ = smd 1.168 x 1.6: 1 -0.762,0; 2 0.762,0
TQFP100 = smd 1.5 x 0.35: 1 -8,6; 2 -8,5.5; 3 -8,5; 4 -8,4.5; 5 -8,4; 6 -8,3.5; 7 -8,3; 8 -8,2.5; 9 -8,2; 10 -8,1.5; 11 -8,1; 12 -8,0.5; 13 -8,0; 14 -8,-0.5; 15 -8,-1; 16 -8,-1.5; 17 -8,-2; 18 -8,-2.5; 19 -8,-3; 20 -8,-3.5; 21 -8,-4; 22 -8,-4.5; 23 -8,-5; 24 -8,-5.5; 25 -8,-6; 51 8,-6; 52 8,-5.5; 53 8,-5; 54 8,-4.5; 55 8,-4; 56 8,-3.5; 57 8,-3; 58 8,-2.5; 59 8,-2; 60 8,-1.5; 61 8,-1; 62 8,-0.5; 63 8,0; 64 8,0.5; 65 8,1; 66 8,1.5; 67 8,2; 68 8,2.5; 69 8,3; 70 8,3.5; 71 8,4; 72 8,4.5; 73 8,5; 74 8,5.5; 75 8,6 | smd 0.35 x 1.5: 26 -6,-8; 27 -5.5,-8; 28 -5,-8; 29 -4.5,-8; 30 -4,-8; 31 -3.5,-8; 32 -3,-8; 33 -2.5,-8; 34 -2,-8; 35 -1.5,-8; 36 -1,-8; 37 -0.5,-8; 38 0,-8; 39 0.5,-8; 40 1,-8; 41 1.5,-8; 42 2,-8; 43 2.5,-8; 44 3,-8; 45 3.5,-8; 46 4,-8; 47 4.5,-8; 48 5,-8; 49 5.5,-8; 50 6,-8; 76 6,8; 77 5.5,8; 78 5,8; 79 4.5,8; 80 4,8; 81 3.5,8; 82 3,8; 83 2.5,8; 84 2,8; 85 1.5,8; 86 1,8; 87 0.5,8; 88 0,8; 89 -0.5,8; 90 -1,8; 91 -1.5,8; 92 -2,8; 93 -2.5,8; 94 -3,8; 95 -3.5,8; 96 -4,8; 97 -4.5,8; 98 -5,8; 99 -5.5,8; 100 -6,8
QFN32 = smd 0.6 x 0.3: 1 -2.3,1.75; 2 -2.3,1.25; 3 -2.3,0.75; 4 -2.3,0.25; 5 -2.3,-0.25; 6 -2.3,-0.75; 7 -2.3,-1.25; 8 -2.3,-1.75; 17 2.3,-1.75; 18 2.3,-1.25; 19 2.3,-0.75; 20 2.3,-0.25; 21 2.3,0.25; 22 2.3,0.75; 23 2.3,1.25; 24 2.3,1.75 | smd 0.3 x 0.6: 9 -1.75,-2.3; 10 -1.25,-2.3; 11 -0.75,-2.3; 12 -0.25,-2.3; 13 0.25,-2.3; 14 0.75,-2.3; 15 1.25,-2.3; 16 1.75,-2.3; 25 1.75,2.3; 26 1.25,2.3; 27 0.75,2.3; 28 0.25,2.3; 29 -0.25,2.3; 30 -0.75,2.3; 31 -1.25,2.3; 32 -1.75,2.3 | smd 3.2 x 3.2: EXP 0,0
2X03 = drill 1.016 octagon: 1 -2.54,-1.27; 2 -2.54,1.27; 3 0,-1.27; 4 0,1.27; 5 2.54,-1.27; 6 2.54,1.27
0805 = smd 1.2 x 1: 1 -1.1,0; 2 1.1,0
QS = drill 0.61 long: 1 -2.54,0; 2 2.54,0
R0603-ROUND = smd 0.898 x 1.1: 1 -0.889,0; 2 0.889,0
SMARTPRJ_R0603-ROUND = smd 0.898 x 1.1: 1 -0.889,0; 2 0.889,0
TS42 = smd 1.6 x 1.4: 1 -4.2,2.25; 2 4.2,2.25; 3 -4.2,-2.25; 4 4.2,-2.25; 5 -4.2,0
CAT16 = smd 0.5 x 0.65: 1 -1.2,-0.675; 2 -0.4,-0.675; 3 0.4,-0.675; 4 1.2,-0.675; 5 1.2,0.675; 6 0.4,0.675; 7 -0.4,0.675; 8 -1.2,0.675
CAY16 = smd 0.5 x 0.65: 1 -1.2,-0.675; 2 -0.4,-0.675; 3 0.4,-0.675; 4 1.2,-0.675; 5 1.2,0.675; 6 0.4,0.675; 7 -0.4,0.675; 8 -1.2,0.675
22-23-2021 = drill 1 long: 1 -1.27,0; 2 1.27,0
22-23-2041 = drill 1 long: 1 -3.81,0; 2 -1.27,0; 3 1.27,0; 4 3.81,0
DRV8825 = smd 0.35 x 1.2: 1 -4.225,-2.975; 2 -3.575,-2.975; 3 -2.925,-2.975; 4 -2.275,-2.975; 5 -1.625,-2.975; 6 -0.975,-2.975; 7 -0.325,-2.975; 8 0.325,-2.975; 9 0.975,-2.975; 10 1.625,-2.975; 11 2.275,-2.975; 12 2.925,-2.975; 13 3.575,-2.975; 14 4.225,-2.975; 15 4.225,2.975; 16 3.575,2.975; 17 2.925,2.975; 18 2.275,2.975; 19 1.625,2.975; 20 0.975,2.975; 21 0.325,2.975; 22 -0.325,2.975; 23 -0.975,2.975; 24 -1.625,2.975; 25 -2.275,2.975; 26 -2.925,2.975; 27 -3.575,2.975; 28 -4.225,2.975 | smd 5.18 x 3.1: HEAT 0,0
MA03-1 = drill 1.016 long: 1 -2.54,0; 2 0,0; 3 2.54,0
SPRING_CONTACT = smd 3.5 x 3.5: P$1 0,0
SMD_4P_SWITCH = smd 0.762 x 1.27: P$1 -1.27,-3.81; P$2 0,-3.81; P$3 1.27,-3.81; P$4 2.54,-3.81; P$5 2.54,3.81; P$6 1.27,3.81; P$7 0,3.81; P$8 -1.27,3.81
SC-88 = smd 0.25 x 0.75: P$1 -0.625,-1.125; P$2 0,-1.125; P$3 0.625,-1.125; P$4 0.625,0.875; P$5 0,0.875; P$6 -0.625,0.875
SMARTPRJ_C0603-ROUND = smd 0.898 x 1.1: 1 -0.889,0; 2 0.889,0
RGBLED = smd 0.65 x 0.85: P$1 -0.425,0.725; P$2 0.425,0.725; P$3 -0.425,-0.725; P$4 0.425,-0.725
0805LED = smd 1.245 x 0.991: P$1 0,0.991; P$2 0,-0.991
MICROUSB_VERT = drill 0.6 pad 0.8: P$1 -1.3,0; P$2 -0.65,-1; P$3 0,0; P$4 0.65,-1; P$5 1.3,0 | drill 0.325 pad 0.75 long: P$6 -3.575,0.11; P$7 3.575,0.11
RESONATOR = smd 0.7 x 2: 1 -1,0; 2 0,0; 3 1,0
CT/CN0603 = smd 1 x 1: 1 -1,0; 2 1,0

### Placement (x,y rotation side)
5  45.84,93.28 180 top
12  98.8,93.53 270 top
24  34.41,13.39 90 top
24V  35.42,16.44 0 top
ANALOG  35.17,54.54 270 top
C1  8.5,15.17 180 top
C2  95.03,95.2 180 bottom
C3  16.88,77.4 270 bottom
C4  17.39,74.86 270 top
C5  26.91,72.96 90 bottom
C6  26.28,83.75 180 top
C7  7.61,19.74 270 top
C8  31.36,32.95 180 top
C9  11.04,34.22 180 bottom
C10  17.64,41.33 270 bottom
C11  88.05,95.13 270 bottom
C12  90.14,94.67 90 bottom
C13  90.09,84.31 180 top
C14  82.19,7.29 180 top
C15  86.13,17.94 270 bottom
C16  15.36,22.16 270 top
C17  11.17,30.28 180 top
C19  83.32,97.28 180 top
C20  76.29,6.97 0 top
C21  90.52,17.05 270 bottom
C22  60.57,97.72 0 top
C23  87.08,9.6 180 bottom
DBG  5.71,76.89 270 top
F1  31.36,36.76 180 top
F2  51.41,90.88 90 top
GND  135.5,32.95 90 top
GROUND  14.22,41.71 180 top
IC3  22.47,73.59 0 top
IC4  13.58,38.03 90 bottom
ICSP  4.69,58.35 270 top
ICSP1  4.69,36.76 270 top
L2  18.02,33.97 270 bottom
Q1  12.31,26.6 0 top
R1  77.31,2.5 180 top
R2  12.31,22.79 180 top
R3  76.48,4.79 180 top
R4  14.34,30.79 270 top
R5  72.4,9.73 90 top
R6  90,86.44 180 top
R7  92.28,94.74 90 bottom
R8  92.78,85.57 270 top
R9  75.89,88.66 180 bottom
R10  75.96,86.63 0 bottom
R11  116.32,32.19 0 top
R12  116.32,35.87 0 top
R13  115.94,44 90 top
R14  118.1,44 270 top
R15  115.18,53.78 90 top
R16  117.34,53.78 90 top
R17  74.51,9.74 270 top
R18  88.23,17.23 270 bottom
R19  90.47,12.31 0 bottom
R20  90.47,14.3 0 bottom
R21  92.76,91.62 0 bottom
R22  92.81,89.29 0 bottom
R23  48,93.15 90 top
R24  38.47,13.39 180 top
R25  95.88,94.8 270 top
RESET  22.47,15.17 0 top
RN1  12.82,15.93 90 top
RN2  19.93,38.03 90 bottom
RN4  7.23,45.65 0 top
RN5  4.56,30.92 270 bottom
RN6  43.3,89.97 270 top
RN7  13.58,85.02 0 top
RN8  23.74,91.12 270 top
RX  7.23,50.73 0 top
SOL-5V  108.83,43.11 90 top
SOL-12V  108.83,34.22 90 top
SR1  108.83,55.81 90 top
SRV2  114.18,66.99 90 top
SRV3  114.14,79.82 90 top
STP1  81.21,13.34 270 bottom
STP2  83.23,90.35 270 bottom
STP-A  107.05,88.11 180 top
STP-A1  105.81,14.96 0 top
STP-B  99,88.06 180 top
STP-B1  112.06,14.71 0 top
SV1  122.8,55.81 270 top
SV2  122.16,65.72 270 top
SV3  121.53,78.67 270 top
TX  4.69,50.73 0 top
U$6  92.7,7.55 0 top
U$8  36.44,88.83 90 top
U$9  51.3,96.45 0 top
U$10  72,2.98 0 top
U$11  72,100.9 0 top
U$12  92.7,96.45 0 top
U$13  51.3,7.55 0 top
U$15  116.45,49.46 0 top
U$16  104.25,30.29 270 top
U$17  103.88,43.24 270 top
U$18  18.41,88.83 0 top
U$19  19.04,85.53 270 top
U$20  12.31,91.12 270 top
U$21  14.85,91.12 270 top
UBOOT  13.45,46.03 0 top
X2  24.25,40.57 90 top
X6  135.5,71.05 90 top
Y2  12.18,20.25 0 top
Z3  20.31,33.97 90 bottom
Z4  20.31,42.09 270 bottom

### Tracks (layer width: path | path; a pad name or v marks a point on that pad's centre or on a via)
+5V  (via drill 0.35)
  Top 0.152: v16.07,35.54 16.07,39.66 16.68,40.27 16.68,41.79 14.85,43.62 | ICSP1.2 10.28,43.62 | RN4.6 7.63,47.12 v7.25,47.5
  Top 0.762: v118.35,51.37 118.73,51.74
  Bottom 0.152: v10,35.37 10,35.24 10.15,35.09 C9.1 10.13,34.17 | v16.07,35.54 15.92,35.69 15.92,36.15 IC4.32 IC4.31 | RN5.1 5.25,32.19 6.1,32.19 v6.25,32.03 | IC4.4 13.83,34.33 v13.5,34 | C5.1 27.17,71.81 v28.06,71.81
  Bottom 0.203: R9.1 73.95,88.66 v73.78,88.83 | v118.35,51.37 115.43,51.37 v115.31,51.49
  Bottom 0.305: v7.25,47.5 10.75,44 v11.25,44
  Bottom 0.508: SV3.3 v129.15,76.13 | SV2.3 122.42,63.43 v129.15,63.43
  Bottom 0.762: v10,84.75 16,84.75 v16.75,84 | v118.35,51.37 v119.88,52.89 | SV1.3 v129.15,53.27
  pour Top (rank 3): -16.9,106.61 -16.9,11.36 3.42,-8.96 152.01,-8.96 159.63,-1.34 159.63,100.26 142.87,117.02 -6.49,117.02
+12V  (via drill 0.5)
  Top 0.152: 117.26,32.19 R11.2 | U$12.P$1 93.46,95.69 R25.1
  Top 0.762: SV1.1 126.25,58.35 | SV2.1 122.42,68.51 126.25,68.51 | SV3.1 126.25,81.21
  Top 1.27: R11.2 120.44,32.19 126.25,38 126.25,58.35 126.25,68.51 126.25,81.21 126.25,84.11 119.48,90.88 109.1,90.88 v109.08,90.86 | C19.+ 91.87,97.28 U$12.P$1
  Top 2.54: X6.7 X6.8 X6.9 X6.10 X6.11 X6.12 127.16,85.02 126.25,84.11
  Bottom 0.254: 93.62,93.91 93.39,94.14 93.39,94.45
  Bottom 0.406: STP2.4 89.26,92.63 89.53,92.89 92.32,92.89 92.45,92.77 92.72,92.49 92.72,88.6 91.94,87.81 88,87.81 87.74,88.08 STP2.11
  Bottom 0.813: C19.+ 88.41,97.28 C12.2 92.21,95.56 R7.2 92.7,95.2 C2.1 93.39,94.45 93.39,93.38 92.85,92.84 92.52,92.84 92.45,92.77
  Bottom 1.27: v109.08,90.86 96.66,90.86 93.62,93.91
+24V
  Top 0.152: 24V.4 39.23,13.52 R24.1
  Top 2.54: U$6.P$1 92.44,7.29 C14.+
  Bottom 0.203: C23.1 86.19,9.51 85.97,9.29 | C21.2 90.34,16.34
  Bottom 0.483: STP1.11 85.76,11.07 85.97,10.85 | STP1.4 86.92,15.62 87.65,16.34 R18.2 90.34,16.34 | C21.2 90.52,14.89 90.44,14.81
  Bottom 0.508: 85.97,10.85 86.07,10.96 89.59,10.96 90.44,11.8 90.44,14.81
  Bottom 0.813: C14.+ 85.97,9.29 85.97,10.85
  Bottom 2.54: C14.+ 83.56,7.29 81.34,5.07 61.78,5.07 55.41,11.44 46.14,11.44 41.14,16.44 24V.4 | 39.23,16.19 24V.4 | 24V.4 24V.3 24V.2 24V.1
AREF  (via drill 0.35)
  Top 0.203: IC3.98 17.47,80.67 17.63,80.51 17.63,79.99 17.26,79.62 17.2,79.62 v16.88,79.31
  Bottom 0.203: v16.88,79.31 C3.1
D+
  Top 0.152: X2.P$3 24.15,40.57 23.38,39.81 23.38,38.89 24.6,37.67 24.91,37.67 25.25,37.33 25.25,27.75 28.75,24.25 28.75,14.25 31.5,11.5 42,11.5 43.5,10 47.43,7.55 U$13.P$1
  Bottom 0.152: Z4.2 20.18,41.03 20.18,40.57 20.64,40.11 20.64,39.35 RN2.5 20.64,39.2 22.62,39.2 23.99,40.57 X2.P$3
D-  (via drill 0.35)
  Top 0.152: U$10.P$1 59.27,2.98 52.5,9.75 44.75,9.75 43.24,10.69 42.13,11.81 31.63,11.81 29.05,14.38 29.05,24.38 25.55,27.88 25.55,36.94 v25.86,37.24
  Bottom 0.152: Z3.2 20.18,35.08 20.18,35.54 20.64,36 20.64,36.76 RN2.8 20.64,36.91 22.16,36.91 23.38,38.13 24.75,38.13 | 24.76,38.13 24.75,38.13 | 25.37,38.75 25.37,39.81 X2.P$2 | 25.37,38.75 25.37,38.74 | 24.75,38.13 25.06,38.44 | 25.06,38.44 25.37,38.75 | v25.86,37.24 25.86,37.64 25.06,38.44
DECAY  (via drill 0.35)
  Top 0.152: IC3.54 32.15,69.09 32.76,68.48 v33.9,68.48
  Bottom 0.152: v33.9,68.48 35.06,68.48 57.59,91.01 72.25,91.01 73.06,90.21 75.23,90.21 R9.2
  Bottom 0.203: STP2.19 76.84,88.73 R9.2 76.85,88.59 R10.1
DECAY-1  (via drill 0.35)
  Top 0.2: IC3.36 21.47,64.23 20.45,63.21 v20.45,62.03 | v70.28,13.03 72.4,10.91 R5.2 R17.1 75.61,11.73 v76.19,11.73
  Bottom 0.2: v20.45,62.03 20.45,51.29 33.24,38.5 33.24,26.99 46.92,13.31 70,13.31 v70.28,13.03 | v76.19,11.73 78.22,11.73 STP1.19
DIR  (via drill 0.35)
  Top 0.152: IC3.55 32.35,69.59 32.56,69.39 v32.99,69.39
  Bottom 0.152: v32.99,69.39 35.53,69.39 57.47,91.32 72.38,91.32 72.88,90.82 76.63,90.82 78.08,89.38 STP2.20
DIR-1  (via drill 0.35)
  Top 0.2: IC3.37 21.97,64.03 21.36,63.41 v21.36,62.94
  Bottom 0.2: v21.36,62.94 21.36,50.88 33.59,38.64 33.59,27.14 47.07,13.66 72.15,13.66 73.44,12.37 STP1.20
DTR  (via drill 0.35)
  Top 0.152: 9.25,37.67 6.47,37.67 5.86,38.28 5.55,38.28 4.94,38.89 4.94,39.81 8.91,43.77 9.97,43.77 12.11,45.9 12.56,45.9 UBOOT.1 | v9.97,37.67 9.25,37.67 | 11.34,30.05 11.34,30.82 11.37,30.84 v11.37,31.13 | 9.25,37.67 9.17,37.6 v9.17,34.48
  Top 0.203: C7.1 7.61,26.32 11.34,30.05
  Bottom 0.152: v9.97,37.67 10.73,38.44 10.89,38.28 11.19,38.28 IC4.13 | v9.17,34.48 9.17,33.33 v11.37,31.13
GND  (via drill 0.35, 0.45, 0.55)
  Top 0.152: IC3.81 26,81.56 v26,80.25 | C4.2 17.61,73.75 v18.75,73.75 | IC3.11 16.16,74.59 v16.25,74.5 | 26,82.25 26,83.14 C6.2 25.25,83.89 v25.25,84.75 | IC3.99 17,81.56 v17,80.25 | RN6.8 RN6.7 RN6.6 RN6.5 44.38,88.37 v44.38,87.87 | R15.2 115.18,55.68 v115.25,55.75 | U$15.P$4 117.08,50.08 115.83,48.83 U$15.P$1 115.74,48.25 v115,48.25 | v115,45.5 115.33,45.5 R13.2 | C16.2 v15.36,20.12 | RESET.1 17.98,17.71 v16.88,17.71 | Y2.2 12.25,20.18 v12.25,18.62 | RESET.2 v26.67,18.84 v26.66,18.85 | C8.2 30.51,32.61 v29.75,31.86 | GROUND.2 13.45,43.2 v13.5,43.25 | UBOOT.2 14.25,46 v14.25,44.5 | C17.2 10.25,30.31 v10.25,31.37 | IC3.32 19.5,65.56 v19.5,64.25 | 5.C v45.84,90.99 | 24.C 31.99,13.39 v31.87,13.52 | 12.C 99.85,93.91 99.09,94.67 v98.8,94.67
  Top 0.2: IC3.62 30.4,73.16 29.62,73.16 28.82,73.96 v28.82,74.86
  Top 0.203: C13.2 88.18,84.31 v88.13,84.26 | C20.2 78.04,6.97 v78.1,6.92 | R1.2 76.39,2.47 v75.3,2.47 | v82.03,86.93 81.78,86.67 81.14,86.67 80.76,86.29 v78.73,86.29 | C1.2 v7.61,16.44 | R6.2 v88,86.44
  Top 0.508: R17.2 73.91,8.25 v73.91,7.42
  Top 0.762: U$11.P$1 v72,98.5 | U$11.P$1 v74.41,100.9 | U$11.P$1 v69.71,100.9
  Top 1.016: v90.54,79.43 v87.62,79.43 | v66.92,95.18 v66.92,87.31
  Top 2.54: v18.41,60.89 18.53,60.89 v29.2,50.22
  Bottom 0.152: v16.25,74.5 16.5,74.5 17.25,73.75 | IC4.EXP 14.33,37.28 IC4.3
  Bottom 0.203: R10.2 74.27,87.43 v74.03,87.43 | STP2.HEAT 83.23,88.12 v82.03,86.93
  pour Bottom (rank 3): -9.28,85.02 -9.28,7.55 4.69,-6.42 146.93,-6.42 157.09,3.74 157.09,95.18 145.83,106.44 12.14,106.44
M8RXD  (via drill 0.35)
  Top 0.152: v11.04,33.56 10.13,33.56 9.36,32.8 2.96,32.8 2.05,33.71 2.05,43.92 v2.96,44.84 | v4.18,46.06 4.64,46.06 5.55,46.97 6.32,46.97 6.92,46.36 RN4.7
  Bottom 0.152: v11.04,33.56 10.89,33.71 10.89,34.78 11.04,34.93 11.04,35.39 11.34,35.69 11.34,36.15 IC4.9 | v4.18,46.06 v2.96,44.84
M8TXD  (via drill 0.35)
  Top 0.152: v12.87,34.78 10.89,34.78 9.21,33.1 3.11,33.1 2.35,33.86 2.35,42.86 v4.18,44.69 | v5.1,45.6 5.4,45.6 6.01,46.21 RN4.8
  Bottom 0.152: v12.87,34.78 12.72,34.63 12.26,35.08 12.11,35.08 11.8,35.39 11.8,35.69 IC4.8 | v5.1,45.6 v4.18,44.69
MISO2
  Bottom 0.152: IC4.17 11.8,40.42 11.19,40.42 10.89,40.72 4.79,40.72 3.42,39.35 ICSP1.1
MODE0  (via drill 0.35)
  Top 0.152: IC3.58 31.94,71.09 32.96,72.11 v33.9,72.11
  Bottom 0.152: v33.9,72.11 36.97,72.11 57.09,92.23 72.76,92.23 73.02,91.98 STP2.24
MODE0-1  (via drill 0.35)
  Top 0.2: IC3.40 23.47,64.03 24.08,63.41 v24.08,62.03
  Bottom 0.2: v24.08,62.03 24.08,49.64 34.65,39.08 34.65,27.58 47.5,14.72 72.29,14.72 72.54,14.97 STP1.24
MODE1  (via drill 0.35)
  Top 0.152: IC3.59 31.73,71.59 v33.08,72.94
  Bottom 0.152: v33.08,72.94 37.36,72.94 56.96,92.54 80.17,92.54 STP2.25
MODE1-1  (via drill 0.35)
  Top 0.2: IC3.41 23.97,64.23 24.99,63.21 v24.99,61.16
  Bottom 0.2: v24.99,61.16 24.99,49.23 35,39.23 35,27.72 47.65,15.07 72.15,15.07 72.69,15.62 STP1.25
MODE2  (via drill 0.35)
  Top 0.152: v33.9,73.93 33.21,73.93 31.37,72.09 IC3.60
  Bottom 0.152: v33.9,73.93 37.92,73.93 56.84,92.84 72,92.84 72.43,93.28 STP2.26
MODE2-1  (via drill 0.35)
  Top 0.2: IC3.42 24.47,64.44 25.9,63.01 v25.9,58.22
  Bottom 0.2: v25.9,58.22 25.9,48.82 35.35,39.37 35.35,27.87 47.8,15.42 72,15.42 72.84,16.27 STP1.26
MOSI2
  Bottom 0.152: IC4.16 11.19,39.81 11.04,39.81 10.58,40.27 9.52,40.27 6.01,36.76 ICSP1.4
N$1
  Bottom 0.203: STP2.1 86.61,94.58 C11.1
N$2
  Top 0.152: U$15.P$2 116.5,48.19 116.5,46.51 118.03,44.99 R14.1
N$3
  Top 0.152: 5.A 46.13,94.04 R23.2
N$4
  Bottom 0.203: C11.2 87.74,93.93 STP2.2
N$5
  Top 0.152: RN6.4 42.59,88.73 41.52,88.73 40.3,87.51 U$8.P$1
N$6  (via drill 0.35)
  Top 0.203: v87.44,87.34 89.98,87.34 R6.1 92.75,86.44 R8.1
  Bottom 0.203: STP2.12 86.29,87.34 v87.44,87.34 86.87,86.78 STP2.13
N$7  (via drill 0.35)
  Top 0.508: STP-A.1 104.43,92 v89.75,92
  Bottom 0.508: STP2.5 90.47,91.98 v90.5,92 v89.75,92
N$8  (via drill 0.35)
  Top 0.508: v87.7,90.75 94.86,90.75 95.52,90.75 103.14,90.75 STP-A.2
  Bottom 0.508: STP2.7 86.91,90.68 87.07,90.84 87.61,90.84 v87.7,90.75 v88.5,90.75
N$9
  Top 0.152: U$8.P$2 40.91,89.49 42.59,89.49 RN6.3
N$10
  Top 0.152: RN6.2 42.59,90.25 40.45,90.25 40.3,90.1 U$8.P$3
N$11
  Top 0.152: RN6.1 42.59,91.32 40.3,91.32 U$8.P$4
N$12  (via drill 0.35)
  Top 0.508: STP-B.2 95.94,89.84 v87.75,89.84
  Bottom 0.483: STP2.8 87.33,90.03 87.38,89.98 87.61,89.98 v87.75,89.84 v88.5,89.84
N$13  (via drill 0.35)
  Top 0.508: STP-B.1 100.27,87.89 99.94,87.56 99.62,87.56 98.21,86.15 97.25,86.15 94.62,88.77 v89.65,88.77
  Bottom 0.508: STP2.10 89.61,88.73 89.64,88.75 | 89.64,88.75 v89.65,88.77 | v90.5,88.75 89.64,88.75
N$14  (via drill 0.35)
  Top 0.203: R8.2 91.35,84.68 C13.1 89.65,85.63 87.51,85.63 87.11,86.04 v81.4,86.04
  Bottom 0.203: STP2.15 81.31,86.13 v81.4,86.04
N$15  (via drill 0.35)
  Top 0.203: R16.2 115.56,52.89 R15.1 116.19,52.89 116.89,53.59 117.78,53.59 121.81,49.57 121.81,35.77 v121.53,35.49 | v101.21,20.25 101.59,20.25 102.09,19.75 103.25,19.75 v110.1,26.6 | v88.51,19.49 88.23,19.21 76.93,19.21 74.9,17.18 65.26,17.18 64.26,18.18 64.17,18.18 v64,18.35 | v31.99,64.45 31.66,64.11 31.66,64.09 28.06,60.49 v28.06,56.19 | IC3.88 22.54,81.66 22.54,82.45 22.87,82.77 v22.87,83.37
  Bottom 0.203: v110.1,26.6 112.64,26.6 v121.53,35.49 | v101.21,20.25 100.44,19.49 v88.51,19.49 | v64,18.35 46.97,18.35 36.77,28.55 36.77,39.98 28.73,48.02 28.73,48.79 28.06,49.45 v28.06,56.19 | v31.99,64.45 31.99,65.34 31.49,65.34 31.12,65.71 31.12,66.23 31.4,66.51 31.4,73.96 25.37,79.99 25.37,80.87 v22.87,83.37
N$16  (via drill 0.35)
  Top 0.152: R13.1 116.04,43.16 118.03,43.16 R14.2
  Top 0.203: R13.1 114.67,41.84 v114.67,37.27 | v109.08,27.11 v102.35,20.38 102.23,20.25 | v89.78,18.85 77.08,18.85 75.05,16.82 64.09,16.82 v63.36,17.55 | v27.29,55.28 27.29,59.1 27.29,60.61 v31.02,64.35 | v21.58,83.37 21.97,82.98 IC3.89
  Bottom 0.203: v109.08,27.11 109.08,31.68 109.35,31.94 110,31.94 110.59,32.53 110.59,33.19 v114.67,37.27 | v102.35,20.38 100.83,18.85 v89.78,18.85 | v63.36,17.55 47.27,17.55 36.41,28.4 36.41,39.83 28.37,47.87 28.37,48.64 27.2,49.81 27.2,51.8 27.29,51.88 v27.29,55.28 | v31.02,64.35 31.02,65.3 30.76,65.56 30.76,66.38 31.02,66.64 31.02,73.83 25.01,79.84 25.01,79.94 v21.58,83.37
N$17
  Top 0.152: 104.61,31.27 104.31,31.27 U$16.1
  Top 0.508: U$15.P$3 119.06,46.35 119.06,42.7 118.99,42.64 118.99,35.49 117.72,34.22 110.1,34.22 SOL-12V.2 104.61,31.27
N$18
  Top 0.508: U$15.P$6 114.78,50.34 SOL-5V.2 104.13,44.38 U$17.1
N$19
  Top 0.508: R11.1 114.67,32.95 SOL-12V.1 105.28,29.4 U$16.2
N$20  (via drill 0.45)
  Top 0.152: 16.68,64.5 16.98,64.8 16.98,65.56 IC3.27 | 6.62,64.5 5.71,65.41 DBG.10
  Top 0.203: 16.68,64.5 16.44,64.26 v16.2,64.26 | v11.38,64.28 6.84,64.28 6.62,64.5
  Bottom 0.203: v16.2,64.26 11.4,64.26 v11.38,64.28
N$21
  Top 0.508: U$17.2 104.38,41.84 SOL-5V.1 108.83,40.57 113.53,35.87 R12.1
N$22
  Top 0.152: IC3.14 14.39,73.18 10.58,73.18 5.71,78.06 DBG.5
N$23
  Top 0.152: RN7.6 14.09,85.83 14.09,85.99 16.07,87.97 17.9,87.97 U$18.P$3
N$24
  Top 0.152: RN7.7 13.33,85.83 13.33,85.99 16.22,88.88 18.51,88.88 18.81,89.19 18.81,89.49 U$18.P$2
N$25
  Top 0.152: RN7.8 12.41,85.83 16.07,89.49 17.9,89.49 U$18.P$1
N$26
  Top 0.152: RN7.4 14.85,84.31 14.85,80.5 15.46,79.89 15.46,78.21 15.31,78.06 14.55,78.06 IC3.4
N$27
  Top 0.152: U$19.P$2 17.9,85.68 14.85,85.68 RN7.5
N$28  (via drill 0.35)
  Top 0.152: U$21.2 14.85,89.19 11.8,86.14 11.8,85.22 12.11,84.92 15.28,84.92 15.68,84.52 v15.68,82.52 | IC3.9 15.34,75.59 v15.75,76
  Bottom 0.152: v15.75,76 15.75,82.52 v15.68,82.52
N$29
  Top 0.152: U$20.2 12.26,90.1 12.26,87.05 11.04,85.83 11.04,77.45 12.41,76.08 14.39,76.08 IC3.8
N$30
  Top 0.152: RN8.4 22.93,89.95 19.57,89.95 18.97,90.56 15.76,90.56 15,91.32 13.02,91.32 12.41,91.93 U$20.1
N$31
  Top 0.152: RN8.3 22.93,90.86 15.92,90.86 14.85,91.93 U$21.1
N$32  (via drill 0.35)
  Top 0.203: IC3.67 30.4,75.66 29.62,75.66 28.56,76.72 28.56,77.87 29.19,78.5 v29.19,78.51 | U$8.P$8 32.63,81.95 v32.5,81.83
  Bottom 0.203: v29.19,78.51 v32.5,81.83
N$33  (via drill 0.35)
  Top 0.203: U$8.P$7 33.01,88.83 33.77,88.07 33.77,86.67 33.01,85.91 33.01,82.6 v33.26,82.35 | IC3.68 31.45,76.09 31.49,76.05 33.06,76.05 v33.17,76.16
  Bottom 0.203: v33.26,82.35 33.9,81.72 33.9,76.89 v33.17,76.16
N$34  (via drill 0.35)
  Top 0.203: v29.19,77.6 29.46,77.6 29.47,77.59 29.47,76.81 29.62,76.66 30.4,76.66 IC3.69 | U$8.P$6 31.99,89.47 31.89,89.47 31.74,89.32 31.74,87.07 32.27,86.54 32.27,83.75 32.02,83.5 v31.92,83.5
  Bottom 0.203: v31.92,83.5 31.92,83.05 31.87,83 31.87,81.7 29.32,79.15 28.93,79.15 28.56,78.78 28.56,78.25 29.19,77.62 v29.19,77.6
N$35  (via drill 0.35)
  Top 0.152: 32.53,91.32 U$8.P$5
  Top 0.203: v28.57,83.24 28.57,83.19 27.97,82.59 27.19,82.59 27.04,82.45 27.04,81.66 IC3.79 | v31.32,84.18 31.92,84.78 31.92,86.39 31.38,86.93 31.38,90.89 31.87,91.37 32.48,91.37 32.53,91.32
  Bottom 0.203: v28.57,83.24 29.5,84.18 v31.32,84.18
N$36
  Top 0.152: U$15.P$5 116.5,50.48 116.5,52 117.26,52.76 R16.1
N$37
  Bottom 0.203: STP1.9 85.32,12.37 85.45,12.23 87.34,12.23 87.49,12.37 89.52,12.37 R19.2
N$38
  Top 2.032: U$9.P$1 51.3,92.94 F2.2
N$39
  Bottom 0.203: STP1.1 85.44,17.57 86.13,18.25 C15.1
N$40
  Bottom 0.203: STP1.2 85.99,16.92 C15.2
N$41  (via drill 0.35)
  Top 0.203: R3.2 75.6,6.77 C20.1 77.08,8.65 v77.08,9.07
  Bottom 0.203: v77.08,9.07 77.12,9.12 STP1.15
N$42  (via drill 0.35)
  Top 0.508: R1.1 78.2,3.96 R3.1 77.55,4.79 79.21,6.45 79.21,7.79 79.91,8.5 81.33,8.5 v82.67,9.84
  Bottom 0.508: STP1.12 83.25,10.42 v82.67,9.84 82.74,9.77 STP1.13
N$43  (via drill 0.35)
  Top 0.508: STP-A1.1 87.79,14.96 v87.75,14.92
  Bottom 0.508: STP1.5 87.7,14.97 v87.75,14.92 v88.51,14.92
N$44  (via drill 0.35)
  Top 0.508: STP-A1.2 105.89,13.77 105.75,13.77 105.02,13.05 104.06,13.05 103.33,13.77 v85.72,13.77
  Bottom 0.483: STP1.7 85.61,13.67 v85.72,13.77 v86.48,13.77
N$45  (via drill 0.35)
  Top 0.508: STP-B1.2 113.33,16 112.51,16.82 110.48,16.82 108.83,15.17 108.83,13.9 107.79,12.86 105.77,12.86 105.29,12.39 103.79,12.39 103.31,12.86 v85.72,12.86
  Bottom 0.483: STP1.8 85.38,13.02 85.4,13 85.58,13 v85.72,12.86 v86.48,12.86
N$46  (via drill 0.35)
  Top 0.508: v87.75,11.74 103.5,11.74 103.51,11.73 107.81,11.73 STP-B1.1
  Bottom 0.508: STP1.10 87.72,11.72 v87.75,11.74 v88.51,11.74
N$47
  Bottom 0.203: STP1.6 85.36,14.32 85.45,14.41 87.24,14.41 87.37,14.28 89.56,14.28 R20.2
N$48
  Bottom 0.152: R21.2 91.58,91.33 88.78,91.33 88.62,91.48 87.58,91.48 87.42,91.33 STP2.6
N$49
  Bottom 0.152: R22.2 91.83,89.38 88.89,89.38 88.75,89.23 87.5,89.23 87.36,89.38 STP2.9
N$50  (via drill 0.35)
  Top 0.203: v22.09,79.56 21.47,80.18 IC3.90
  Bottom 0.203: v22.09,79.56 25.97,75.68 25.97,68.51 31.05,63.43 ANALOG.1
N$51  (via drill 0.35)
  Top 0.203: v22.09,78.27 20.97,79.39 IC3.91
  Bottom 0.203: v22.09,78.27 25.47,74.89 25.47,68.3 30.84,62.93 32.38,62.93 34.42,60.89 ANALOG.2
N$52  (via drill 0.35)
  Top 0.203: v20.95,78.51 20.47,78.99 IC3.92
  Bottom 0.203: v20.95,78.51 24.97,74.49 24.97,68.1 30.64,62.43 31.38,62.43 34.42,59.39 34.42,58.35 ANALOG.3
N$53  (via drill 0.35)
  Top 0.203: v23.74,73.67 19.97,77.44 IC3.93
  Bottom 0.203: v23.74,73.67 24.47,72.94 24.47,67.89 30.43,61.93 31.37,61.93 33.05,60.25 33.05,57.17 34.42,55.81 ANALOG.4
N$54
  Top 0.152: RN4.4 8.45,44.99 8.91,45.45 9.06,45.45 9.36,45.75 9.36,47.43 7.23,49.56 RX.A
N$55
  Top 0.152: RN4.3 7.69,44.99 7.69,45.14 8.3,45.75 8.91,45.75 9.06,45.9 9.06,46.67 6.92,48.8 5.55,48.8 4.79,49.56 TX.A
N$56  (via drill 0.35)
  Top 0.203: v22.09,74.42 19.47,77.04 IC3.94
  Bottom 0.203: v22.09,74.42 23.97,72.54 23.97,67.68 30.22,61.43 31.37,61.43 32.7,60.1 32.7,54.99 34.42,53.27 ANALOG.5
N$57  (via drill 0.35)
  Top 0.203: v22.09,73.13 18.97,76.25 IC3.95
  Bottom 0.203: v22.09,73.13 23.47,71.75 23.47,67.47 30.01,60.93 31.37,60.93 32.34,59.96 32.34,52.81 34.42,50.73 ANALOG.6
N$58  (via drill 0.35)
  Top 0.203: IC3.96 18.47,76.32 18.55,76.24 18.55,75.39 v22.09,71.85
  Bottom 0.203: v22.09,71.85 22.97,70.97 22.97,67.27 29.81,60.43 31.36,60.43 31.91,59.88 31.91,50.7 34.42,48.19 ANALOG.7
N$59  (via drill 0.35)
  Top 0.203: IC3.97 17.97,80.68 17.99,80.66 17.99,76.3 18.19,76.09 18.19,75.41 17.97,75.18 17.97,74.68 18.27,74.38 19.01,74.38 19.38,74.01 19.38,73.27 v22.09,70.56
  Bottom 0.203: v22.09,70.56 22.47,70.18 22.47,67.06 29.05,60.48 29.1,60.48 29.65,59.93 31.36,59.93 31.36,48.71 34.42,45.65 ANALOG.8
N$60
  Top 0.762: SR1.2 110.08,55.79 110.12,55.79 111.41,57.08 118.99,57.08 120.26,55.81 SV1.2
N$61
  Top 0.762: SV2.2 SRV2.2
N$62
  Top 0.762: SV3.2 121.41,78.55 SRV3.2
N$63  (via drill 0.45)
  Bottom 1.27: v21.45,92.01 v25.65,92.01
N$64
  Top 0.152: 24.A R24.2
N$66
  Top 0.152: R25.2 97.37,93.91 12.A
NENBL  (via drill 0.35)
  Top 0.152: IC3.56 32.35,70.09 32.56,70.29 v33.9,70.29
  Bottom 0.152: v33.9,70.29 36.01,70.29 57.34,91.62 72.5,91.62 72.93,91.2 77.4,91.2 78.58,90.03 STP2.21
NENBL-1  (via drill 0.35)
  Top 0.2: IC3.38 22.47,63.82 22.27,63.61 v22.27,62.03
  Bottom 0.2: v22.27,62.03 22.27,50.47 33.94,38.79 33.94,27.29 47.21,14.01 72.29,14.01 73.29,13.02 STP1.21
NFAULT  (via drill 0.35)
  Top 0.152: IC3.51 31.15,67.59 v32.99,65.75
  Top 0.203: v72,89.8 73.15,88.65 73.15,88.57 73.65,88.07 v77.84,88.07
  Bottom 0.152: v32.99,65.75 33.85,65.75 58.2,90.1 72,90.1 v72,89.8
  Bottom 0.203: STP2.18 v77.85,88.08 v77.84,88.07
NFAULT-1  (via drill 0.35)
  Top 0.2: v74.41,11.73 71.75,14.4 v71.75,16.06 | v31.75,76.69 31.35,77.09 IC3.70
  Top 0.203: v31.75,65.97 26.66,60.88 v26.66,59.36
  Bottom 0.2: STP1.18 75.08,11.07 v74.41,11.73 | v71.75,16.06 47.66,16.06 35.7,28.02 35.7,39.52 26.66,48.57 v26.66,59.36 | v31.75,76.69 33.3,75.14 31.75,73.59 v31.75,65.97
NHOME  (via drill 0.35)
  Top 0.152: v33.9,66.66 32.96,66.66 31.52,68.09 IC3.52
  Bottom 0.152: 34.1,66.66 v33.9,66.66 33.04,66.66 32.38,67.32 32.38,73.27 33.66,74.55 36.44,74.55 36.65,74.55
  Bottom 0.203: 36.44,74.55 38.08,74.55 56.7,93.17 71.86,93.17 72.3,93.61 79.06,93.61 79.38,93.93 STP2.27
NHOME-1  (via drill 0.35)
  Top 0.2: 17.37,58.75 17.58,58.54 v27.74,48.38
  Top 0.203: IC3.28 17.47,64.61 16.88,64.03 16.88,59.23 17.58,58.54
  Bottom 0.2: STP1.27 47.39,16.92 36.06,28.25 36.06,39.68 27.55,48.19
  Bottom 0.203: v27.74,48.38 27.55,48.19
NSLEEP  (via drill 0.35)
  Top 0.152: v32.99,67.57 32.75,67.57 31.73,68.59 IC3.53
  Top 0.203: v79.11,87.44 78.47,88.08 78.47,88.33 77.2,89.6 v74.4,89.6
  Bottom 0.152: v32.99,67.57 34.58,67.57 57.72,90.71 72.13,90.71 73.24,89.6 | 79.78,87.43 STP2.17
  Bottom 0.203: STP2.17 79.13,87.43 v79.11,87.44 | v74.4,89.6 73.24,89.6
NSLEEP-1  (via drill 0.35)
  Top 0.2: IC3.35 20.97,64.44 19.54,63.01 v19.54,62.94
  Bottom 0.2: v19.54,62.94 19.54,51.7 32.88,38.35 32.88,26.85 46.77,12.96 69.46,12.96 72,10.42 STP1.17
NSTEP  (via drill 0.35)
  Top 0.152: IC3.57 32.15,70.59 32.76,71.2 v32.99,71.2
  Bottom 0.152: v32.99,71.2 36.49,71.2 57.22,91.93 72.63,91.93 73.04,91.52 78.12,91.52 78.97,90.68 STP2.22
NSTEP-1  (via drill 0.35)
  Top 0.2: IC3.39 22.97,63.82 23.17,63.61 v23.17,62.94
  Bottom 0.2: v23.17,62.94 23.17,50.05 34.29,38.94 34.29,27.43 47.36,14.37 72.44,14.37 73.14,13.67 STP1.22
PA5  (via drill 0.35)
  Top 0.203: v49.19,78.16 48.91,78.44 48.91,78.58 48.54,78.95 46.51,78.95 45.84,78.28 37.96,78.28 37.85,78.28 33.91,78.28 33.6,78.59 31.98,78.59 31.36,78.59 IC3.73
  Bottom 0.203: v49.19,78.16 48.91,78.44 48.91,78.58 48.88,78.61 48.88,78.8 58.73,88.65 70.39,88.65 75.09,83.95 78.27,83.95 78.86,83.37 85.21,83.37 99.65,68.93 99.65,68.3 101.22,66.73 101.85,66.73 108.83,59.75 SR1.4
PA6  (via drill 0.35)
  Top 0.203: SRV2.4 100.34,84.64 94.39,84.64 92.89,83.15 87.84,83.15 86.33,84.66 81.43,84.66 81.15,84.39 80.63,84.39 80.35,84.66 79.64,84.66 v79.37,84.39 | v47.38,77.92 46.84,77.92 46.68,78.09 46.15,78.09 45.99,77.92 33.75,77.92 33.59,78.09 IC3.72
  Bottom 0.203: v47.38,77.92 47.2,78.1 47.17,78.1 58.43,89.36 70.69,89.36 75.39,84.66 79.09,84.66 v79.37,84.39
PA7  (via drill 0.35)
  Top 0.203: v76.83,94.29 83.05,88.07 94.61,88.07 97.03,85.64 110.12,85.64 112.12,83.63 SRV3.4 | v38.53,77.29 38.25,77.57 33.61,77.57 33.58,77.59 IC3.71
  Bottom 0.203: v38.53,77.29 40.31,77.29 56.55,93.53 71.72,93.53 72.15,93.96 76.5,93.96 v76.83,94.29
PB1  (via drill 0.35)
  Top 0.152: v13.17,70.14 14.39,70.14 IC3.20
  Bottom 0.152: v13.17,70.14 4.79,61.75 4.79,60.38 4.33,59.93 4.33,59.32 3.42,58.4 ICSP.3
PB2
  Top 0.152: IC3.21 14.39,69.53 9.52,69.53 6.77,66.78 4.33,66.78 2.35,64.8 2.35,60.53 3.42,59.47 4.79,59.47 5.86,58.4 ICSP.4
PB3
  Top 0.152: ICSP.1 3.42,65.41 4.49,66.48 6.92,66.48 9.52,69.07 14.39,69.07 IC3.22
PB5  (via drill 0.35, 0.45)
  Top 0.203: v29.71,59.11 29.71,60.76 32.98,64.04 32.98,64.16 34.9,66.07 34.9,73.6 35.19,73.9 43.86,73.9 46.37,76.41 47.27,76.41 48.11,77.25 v49.14,77.25 | IC3.24 14.4,68.02 13.35,68.02 11.94,66.61 v11.94,65.15
  Bottom 0.203: v49.14,77.25 49.42,77.53 49.45,77.53 49.82,77.9 49.82,79.24 58.87,88.3 70.25,88.3 74.94,83.6 78.13,83.6 78.71,83.01 85.06,83.01 93.4,74.67 93.36,74.7 94.66,73.4 94.67,73.4 99.3,68.78 99.3,68.15 100.83,66.62 100.83,65.08 SR1.3 | v29.71,59.11 29.33,59.5 29.33,59.76 28.95,60.13 28.7,60.13 23.36,65.46 13.6,65.46 13.23,65.84 12.62,65.84 v11.94,65.15
PB6  (via drill 0.35, 0.45)
  Top 0.203: SRV2.3 112,70.44 112,72.32 | 112,72.32 112,72.47 | 112,72.32 100.04,84.29 94.53,84.29 93.04,82.79 87.7,82.79 86.18,84.31 81.97,84.31 v81.69,84.03 | v28.69,59.49 28.69,60.36 32.14,63.81 32.26,63.81 32.63,64.18 32.63,64.3 34.54,66.22 34.54,73.75 35.04,74.25 43.71,74.25 46.23,76.77 47.12,76.77 48.02,77.66 48.02,78.05 v48.28,78.31 | v12.95,65.15 12.95,67.11 13.42,67.59 IC3.25
  Bottom 0.203: v81.69,84.03 79.9,84.03 79.63,83.76 78.98,83.76 78.43,84.31 75.24,84.31 70.54,89.01 58.58,89.01 48.28,78.71 v48.28,78.31 | v28.69,59.49 23.08,65.1 12.99,65.1 v12.95,65.15
PB7  (via drill 0.35, 0.45)
  Top 0.203: SRV3.3 109.96,85.27 94.52,85.27 92.74,83.5 87.99,83.5 86.47,85.02 v80.89,85.02 | v46.41,77.46 43.56,74.61 32.18,74.61 v32.03,74.76 | v26.91,80.22 22.72,76.03 22.34,76.03 v20.96,77.42 | IC3.26 16.54,65.66 16.54,66.45 19.75,69.65 v19.8,69.65
  Bottom 0.203: v80.89,85.02 75.53,85.02 70.83,89.72 58.28,89.72 46.75,78.18 46.75,77.79 v46.41,77.46 | v32.03,74.76 31.14,74.76 26.91,78.99 v26.91,80.22 | v20.96,77.42 19.8,76.26 v19.8,69.65
PE0  (via drill 0.35)
  Top 0.152: v10.43,81.72 9.52,81.72 6.92,84.31 4.49,84.31 2.05,81.87 2.05,55.66 2.96,54.74 3.27,54.74 5.55,52.46 5.55,51.85 6.47,50.93 7.53,50.93 9.67,48.8 9.67,45.29 8.75,44.38 7.23,44.38 6.92,44.69 6.92,44.84 RN4.2 | v13.17,78.98 13.48,78.98 13.63,79.13 14.39,79.13 IC3.2
  Bottom 0.152: v13.17,78.98 v10.43,81.72
PE1  (via drill 0.35)
  Top 0.152: v9.67,82.48 7.53,84.61 4.33,84.61 1.98,82.27 1.98,82.24 1.74,82 1.74,55.01 v2.5,54.25 | v12.56,78.21 13.33,78.21 13.63,78.52 14.39,78.52 IC3.3 | RN4.1 6.01,44.99 4.79,44.99 4.33,45.45 3.25,45.45 3.09,45.6 3.02,45.6 2.5,46.12 v2.5,47
  Bottom 0.152: v9.67,82.48 9.67,81.11 v12.56,78.21 | v2.5,47 v2.5,54.25
PE3
  Top 0.152: RN7.3 13.94,84.31 13.94,80.65 11.95,78.67 11.95,77.91 12.26,77.6 14.39,77.6 IC3.5
PE4
  Top 0.152: RN7.2 13.17,84.31 13.17,80.35 11.65,78.82 11.65,77.76 12.26,77.15 14.39,77.15 IC3.6
PE5
  Top 0.152: RN7.1 12.26,84.31 12.26,79.89 11.34,78.98 11.34,77.6 12.41,76.54 14.39,76.54 IC3.7
PH3
  Top 0.152: DBG.6 8.75,72.57 14.39,72.57 IC3.15
PH4
  Top 0.152: IC3.16 14.39,72.12 6.62,72.12 5.71,73.03 DBG.7
PH5
  Top 0.152: IC3.17 14.39,71.51 6.62,71.51 5.71,70.59 DBG.8
PH6
  Top 0.152: DBG.9 8.75,71.05 14.39,71.05 IC3.18
RD+
  Bottom 0.152: IC4.29 15.92,37.67 16.53,37.67 16.68,37.83 16.98,37.52 16.98,34.63 17.59,34.02 18.97,34.02 19.12,34.17 19.12,35.85 18.35,36.61 18.35,38.89 18.66,39.2 19.12,39.2 RN2.4
RD-
  Bottom 0.152: IC4.30 15.92,37.22 16.22,37.22 16.68,36.76 16.68,34.47 17.44,33.71 19.12,33.71 19.42,34.02 19.42,36.15 19.27,36.3 19.27,36.76 RN2.1
RESET  (via drill 0.35)
  Top 0.152: ICSP.5 4.49,56.88 v10.58,56.88 10.58,51.39 16.99,44.98 v16.99,33.2 | IC3.30 18.51,65.56 18.51,64.76 v18,64.25 | 7.64,18.8 C7.2 | 16.37,12.83 18.2,12.83 RESET.3 18.35,12.99 26.59,12.99 RESET.4 | 13.44,14.72 RN1.1 | 16.25,12.83 16.25,18.02 17.29,19.06 17.29,29.5 v17.26,29.52
  Top 0.203: 16.37,12.83 16.25,12.83 14.65,12.83 13.44,14.04 | 13.44,14.72 13.44,14.04 | 13.44,14.04 10.52,14.04 C1.1 9.39,17.05 7.64,18.8
  Bottom 0.152: v17.26,29.52 17.26,32.94 v16.99,33.2 | v10.58,56.88 17.96,64.25 v18,64.25
RESET2  (via drill 0.35)
  Top 0.152: v16.07,40.57 10.73,35.24 10.73,35.08 9.53,33.88 7.83,33.88 6.47,35.24 4.33,35.24 3.42,34.32 ICSP1.5
  Bottom 0.152: v16.07,40.57 16.07,40.42 15.92,40.27 15.46,40.27 IC4.24 | ICSP1.5 3.42,33.1 3.88,32.65 3.88,32.19 RN5.8
RXD2
  Top 0.152: DBG.3 7.53,81.41 7.53,80.19 13.63,74.1 14.39,74.1 IC3.12
RXL  (via drill 0.35)
  Top 0.152: RX.C 7.23,51.7 9.97,48.95 9.97,45.14 8.91,44.08 8.75,44.08 4.64,39.96 4.64,36.61 5.55,35.69 6.25,35.69 6.32,35.69 8.06,35.69 v8.07,35.68
  Bottom 0.152: IC4.10 11.19,36.76 11.04,36.76 10.89,36.91 10.58,36.91 9.35,35.68 v8.07,35.68
SCK2
  Bottom 0.152: ICSP1.3 4.33,35.85 4.79,35.85 5.1,35.54 5.25,35.54 5.4,35.69 6.32,35.69 6.47,35.85 6.92,35.85 9.36,38.28 9.97,38.28 11.04,39.35 11.19,39.35 IC4.15
TXD2
  Top 0.152: IC3.13 14.39,73.64 12.72,73.64 5.71,80.65 DBG.4
TXL  (via drill 0.35)
  Top 0.152: TX.C 3.75,50.84 v3.75,50.75
  Bottom 0.152: IC4.11 11.19,37.22 11.04,37.22 10.89,37.37 10.58,37.37 10.13,36.91 8.45,36.91 7.08,35.54 6.62,35.54 6.32,35.24 5.55,35.24 5.4,35.08 5.1,35.08 4.79,35.39 2.81,35.39 2.05,36.15 2.05,44.99 3.75,46.69 v3.75,50.75
UGND  (via drill 0.35)
  Top 0.152: v12.26,41.18 12.87,40.57 14.09,40.57 14.85,41.33 14.85,41.64 GROUND.1
  Bottom 0.152: 16.68,38.74 17.59,39.66 17.59,40.42 C10.2 17.59,40.57 18.81,41.79 18.81,42.09 | 16.68,38.74 16.22,38.28 15.92,38.28 IC4.28 | 16.68,38.74 18.05,37.37 18.05,35.08 L2.1 | v12.26,41.18 15,41.18 17.14,43.31 18.2,43.31 18.81,42.7 18.81,42.09 | 18.81,42.09 19.42,42.09 19.57,42.25 20.95,42.25 21.1,42.09 21.86,42.09 22.77,43.01 24.76,43.01 25.21,42.55 25.21,42.4 25.37,42.25 25.37,41.33 X2.P$4
USHIELD
  Top 0.152: X2.P$6 23.99,37.07 23.99,37.83 23.08,38.74 23.08,43.16 23.99,44.08 X2.P$7
  Bottom 0.152: L2.2 18.05,32.95 20.18,32.95 Z3.1 20.34,33.1 21.1,33.1 23.99,36 23.99,36.91 X2.P$6 | Z4.1 20.34,43.16 22.47,43.16 23.38,44.08 23.99,44.08 X2.P$7
VCCPIN
  Top 0.152: F1.2 27.19,36.76 24.76,39.2 24.3,39.2 X2.P$1
VCP
  Bottom 0.203: STP2.3 88.49,93.28 88.99,93.78 C12.1 90.2,93.85 R7.1
VCP-1
  Bottom 0.203: STP1.3 86.68,16.27 88.23,17.81 R18.1 88.41,17.94 C21.1
VUCAP
  Bottom 0.152: IC4.27 15.92,38.89 16.37,38.89 16.83,39.35 16.83,40.88 16.68,41.03 17.75,42.09 C10.1
XT1
  Top 0.152: R4.2 14.39,29.9 14.39,27.16 14.85,26.7 Q1.2 14.85,22.89 | 14.85,22.89 15.16,22.89 15.31,23.04 C16.1 14.85,22.89 | 14.85,22.89 13.33,22.89 R2.1 13.33,22.74 13.33,20.3 Y2.3
XT1R  (via drill 0.35)
  Top 0.152: v15.31,34.78 15.31,32.65 R4.1
  Bottom 0.152: v15.31,34.78 15.31,34.93 15.46,35.08 15.46,35.39 15.31,35.54 15.31,35.69 IC4.1
XT2
  Top 0.152: Y2.1 11.19,20.3 11.34,20.45 11.34,22.74 R2.2 11.34,22.89 11.34,25.03 Q1.1 9.82,26.7 11.95,28.84 11.95,30.21 C17.1
  Bottom 0.152: IC4.2 14.85,35.69 14.85,35.39 14.7,35.24 14.7,32.8 9.67,27.77 9.67,26.7 Q1.1

### Text on the board
tPlace: GND | 5V | 3 | 12V | 12V | 5V | 12V | 10 | 1 | 5V | 5V | 12V | 5V | 8
bPlace: Universal Tool Board / Rev 1.0 / Dylan Tomberlin / For Cartesian Robotics